# Altium project QCLogic Rev A.PrjPcb (part 1 of 2)
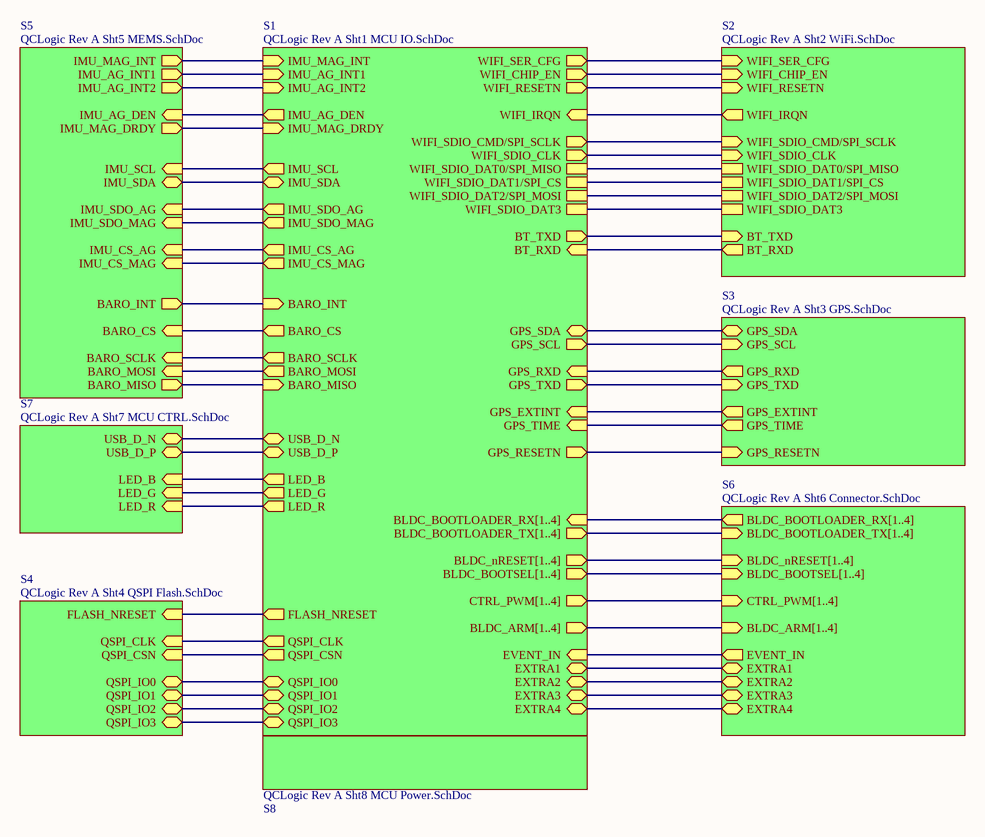
[diagram p0: QCLogic Rev A Sht0 Top.SchDoc]
9 sheets, 239 parts. Net scope: hierarchical (ports join the sheet entries above them; power ports are global).
Board file: QCLogic Rev A.PcbDoc
Sheets:
  QCLogic Rev A Sht0 Top.SchDoc
    S1 = QCLogic Rev A Sht1 MCU IO.SchDoc
    S2 = QCLogic Rev A Sht2 WiFi.SchDoc
    S3 = QCLogic Rev A Sht3 GPS.SchDoc
    S4 = QCLogic Rev A Sht4 QSPI Flash.SchDoc
    S5 = QCLogic Rev A Sht5 MEMS.SchDoc
    S6 = QCLogic Rev A Sht6 Connector.SchDoc
    S7 = QCLogic Rev A Sht7 MCU CTRL.SchDoc
    S8 = QCLogic Rev A Sht8 MCU Power.SchDoc

## Sheet QCLogic Rev A Sht0 Top.SchDoc
size A4

### Sub-sheets
S1 = QCLogic Rev A Sht1 MCU IO.SchDoc: IMU_MAG_INT (in), IMU_AG_INT1 (in), IMU_AG_INT2 (in), IMU_AG_DEN (out), IMU_MAG_DRDY (in), IMU_SCL (out), IMU_SDA (bidir), IMU_SDO_AG (out), IMU_SDO_MAG (out), IMU_CS_AG (out), IMU_CS_MAG (out), BARO_INT (in), BARO_CS (out), BARO_SCLK (out), BARO_MOSI (out), BARO_MISO (in), USB_D_N (bidir), USB_D_P (bidir), WIFI_SER_CFG (out), WIFI_CHIP_EN (out), WIFI_RESETN (out), WIFI_IRQN (in), WIFI_SDIO_CMD/SPI_SCLK (out), WIFI_SDIO_CLK (out), WIFI_SDIO_DAT0/SPI_MISO, WIFI_SDIO_DAT1/SPI_CS, WIFI_SDIO_DAT2/SPI_MOSI, WIFI_SDIO_DAT3, BT_TXD (out), BT_RXD (in), GPS_RXD (in), GPS_TXD (out), GPS_EXTINT (in), GPS_TIME (in), GPS_RESETN (out), GPS_SCL (out), GPS_SDA (bidir), BLDC_BOOTLOADER_RX[1..4] (in), BLDC_BOOTLOADER_TX[1..4] (out), BLDC_nRESET[1..4] (out), BLDC_BOOTSEL[1..4] (out), CTRL_PWM[1..4] (out), FLASH_NRESET (out), QSPI_CLK (out), QSPI_CSN (out), QSPI_IO0 (bidir), QSPI_IO1 (bidir), QSPI_IO2 (bidir), QSPI_IO3 (bidir), LED_B (out), LED_G (out), LED_R (out), BLDC_ARM[1..4] (out), EVENT_IN (in), EXTRA1 (bidir), EXTRA2 (bidir), EXTRA3 (bidir), EXTRA4 (bidir)
S2 = QCLogic Rev A Sht2 WiFi.SchDoc: WIFI_SER_CFG (in), WIFI_CHIP_EN (in), WIFI_RESETN (in), WIFI_IRQN (out), WIFI_SDIO_CMD/SPI_SCLK (in), WIFI_SDIO_CLK (in), WIFI_SDIO_DAT0/SPI_MISO, WIFI_SDIO_DAT1/SPI_CS, WIFI_SDIO_DAT2/SPI_MOSI, WIFI_SDIO_DAT3, BT_TXD (in), BT_RXD (out)
S3 = QCLogic Rev A Sht3 GPS.SchDoc: GPS_SDA (bidir), GPS_SCL (in), GPS_RXD (out), GPS_TXD (in), GPS_EXTINT (out), GPS_TIME (out), GPS_RESETN (in)
S4 = QCLogic Rev A Sht4 QSPI Flash.SchDoc: FLASH_NRESET (in), QSPI_CLK (in), QSPI_CSN (in), QSPI_IO0 (bidir), QSPI_IO1 (bidir), QSPI_IO2 (bidir), QSPI_IO3 (bidir)
S5 = QCLogic Rev A Sht5 MEMS.SchDoc: IMU_MAG_INT (out), IMU_AG_INT1 (out), IMU_AG_INT2 (out), IMU_AG_DEN (in), IMU_MAG_DRDY (out), IMU_SCL (in), IMU_SDA (bidir), IMU_SDO_AG (in), IMU_SDO_MAG (in), IMU_CS_AG (in), IMU_CS_MAG (in), BARO_INT (out), BARO_CS (in), BARO_SCLK (in), BARO_MOSI (in), BARO_MISO (out)
S6 = QCLogic Rev A Sht6 Connector.SchDoc: BLDC_BOOTLOADER_RX[1..4] (out), BLDC_BOOTLOADER_TX[1..4] (in), BLDC_nRESET[1..4] (in), BLDC_BOOTSEL[1..4] (in), CTRL_PWM[1..4] (in), BLDC_ARM[1..4] (in), EVENT_IN (out), EXTRA1 (bidir), EXTRA2 (bidir), EXTRA3 (bidir), EXTRA4 (bidir)
S7 = QCLogic Rev A Sht7 MCU CTRL.SchDoc: USB_D_N (bidir), USB_D_P (bidir), LED_B (in), LED_G (in), LED_R (in)
S8 = QCLogic Rev A Sht8 MCU Power.SchDoc: no entries

### Nets
BARO_CS: sheet S1/BARO_CS, sheet S5/BARO_CS
BARO_INT: sheet S1/BARO_INT, sheet S5/BARO_INT
BARO_MISO: sheet S1/BARO_MISO, sheet S5/BARO_MISO
BARO_MOSI: sheet S1/BARO_MOSI, sheet S5/BARO_MOSI
BARO_SCLK: sheet S1/BARO_SCLK, sheet S5/BARO_SCLK
BT_RXD: sheet S1/BT_RXD, sheet S2/BT_RXD
BT_TXD: sheet S1/BT_TXD, sheet S2/BT_TXD
EVENT_IN: sheet S1/EVENT_IN, sheet S6/EVENT_IN
EXTRA1: sheet S1/EXTRA1, sheet S6/EXTRA1
EXTRA2: sheet S1/EXTRA2, sheet S6/EXTRA2
EXTRA3: sheet S1/EXTRA3, sheet S6/EXTRA3
EXTRA4: sheet S1/EXTRA4, sheet S6/EXTRA4
FLASH_NRESET: sheet S1/FLASH_NRESET, sheet S4/FLASH_NRESET
GPS_EXTINT: sheet S1/GPS_EXTINT, sheet S3/GPS_EXTINT
GPS_RESETN: sheet S1/GPS_RESETN, sheet S3/GPS_RESETN
GPS_RXD: sheet S1/GPS_RXD, sheet S3/GPS_RXD
GPS_SCL: sheet S1/GPS_SCL, sheet S3/GPS_SCL
GPS_SDA: sheet S1/GPS_SDA, sheet S3/GPS_SDA
GPS_TIME: sheet S1/GPS_TIME, sheet S3/GPS_TIME
GPS_TXD: sheet S1/GPS_TXD, sheet S3/GPS_TXD
IMU_AG_DEN: sheet S1/IMU_AG_DEN, sheet S5/IMU_AG_DEN
IMU_AG_INT1: sheet S1/IMU_AG_INT1, sheet S5/IMU_AG_INT1
IMU_AG_INT2: sheet S1/IMU_AG_INT2, sheet S5/IMU_AG_INT2
IMU_CS_AG: sheet S1/IMU_CS_AG, sheet S5/IMU_CS_AG
IMU_CS_MAG: sheet S1/IMU_CS_MAG, sheet S5/IMU_CS_MAG
IMU_INT_MAG: sheet S1/IMU_MAG_INT, sheet S5/IMU_MAG_INT
IMU_MAG_DRDY: sheet S1/IMU_MAG_DRDY, sheet S5/IMU_MAG_DRDY
IMU_SCL: sheet S1/IMU_SCL, sheet S5/IMU_SCL
IMU_SDA: sheet S1/IMU_SDA, sheet S5/IMU_SDA
IMU_SDO_AG: sheet S1/IMU_SDO_AG, sheet S5/IMU_SDO_AG
IMU_SDO_MAG: sheet S1/IMU_SDO_MAG, sheet S5/IMU_SDO_MAG
LED_B: sheet S1/LED_B, sheet S7/LED_B
LED_G: sheet S1/LED_G, sheet S7/LED_G
LED_R: sheet S1/LED_R, sheet S7/LED_R
QSPI_CLK: sheet S1/QSPI_CLK, sheet S4/QSPI_CLK
QSPI_CSN: sheet S1/QSPI_CSN, sheet S4/QSPI_CSN
QSPI_IO0: sheet S1/QSPI_IO0, sheet S4/QSPI_IO0
QSPI_IO1: sheet S1/QSPI_IO1, sheet S4/QSPI_IO1
QSPI_IO2: sheet S1/QSPI_IO2, sheet S4/QSPI_IO2
QSPI_IO3: sheet S1/QSPI_IO3, sheet S4/QSPI_IO3
USB_D_N: sheet S1/USB_D_N, sheet S7/USB_D_N
USB_D_P: sheet S1/USB_D_P, sheet S7/USB_D_P
WIFI_CHIP_EN: sheet S1/WIFI_CHIP_EN, sheet S2/WIFI_CHIP_EN
WIFI_IRQN: sheet S1/WIFI_IRQN, sheet S2/WIFI_IRQN
WIFI_RESETN: sheet S1/WIFI_RESETN, sheet S2/WIFI_RESETN
WIFI_SDIO_CLK: sheet S1/WIFI_SDIO_CLK, sheet S2/WIFI_SDIO_CLK
WIFI_SDIO_CMD/SPI_SCLK: sheet S1/WIFI_SDIO_CMD/SPI_SCLK, sheet S2/WIFI_SDIO_CMD/SPI_SCLK
WIFI_SDIO_DAT0/SPI_MISO: sheet S1/WIFI_SDIO_DAT0/SPI_MISO, sheet S2/WIFI_SDIO_DAT0/SPI_MISO
WIFI_SDIO_DAT1/SPI_CS: sheet S1/WIFI_SDIO_DAT1/SPI_CS, sheet S2/WIFI_SDIO_DAT1/SPI_CS
WIFI_SDIO_DAT2/SPI_MOSI: sheet S1/WIFI_SDIO_DAT2/SPI_MOSI, sheet S2/WIFI_SDIO_DAT2/SPI_MOSI
WIFI_SDIO_DAT3: sheet S1/WIFI_SDIO_DAT3, sheet S2/WIFI_SDIO_DAT3
WIFI_SER_CFG: sheet S1/WIFI_SER_CFG, sheet S2/WIFI_SER_CFG

### Buses and harness runs
bus sheet S1/BLDC_ARM[1..4] = sheet S6/BLDC_ARM[1..4]
bus sheet S1/BLDC_BOOTLOADER_RX[1..4] = sheet S6/BLDC_BOOTLOADER_RX[1..4]
bus sheet S1/BLDC_BOOTLOADER_TX[1..4] = sheet S6/BLDC_BOOTLOADER_TX[1..4]
bus sheet S1/BLDC_BOOTSEL[1..4] = sheet S6/BLDC_BOOTSEL[1..4]
bus sheet S1/BLDC_nRESET[1..4] = sheet S6/BLDC_nRESET[1..4]
bus sheet S1/CTRL_PWM[1..4] = sheet S6/CTRL_PWM[1..4]

## Sheet QCLogic Rev A Sht1 MCU IO.SchDoc
size A3
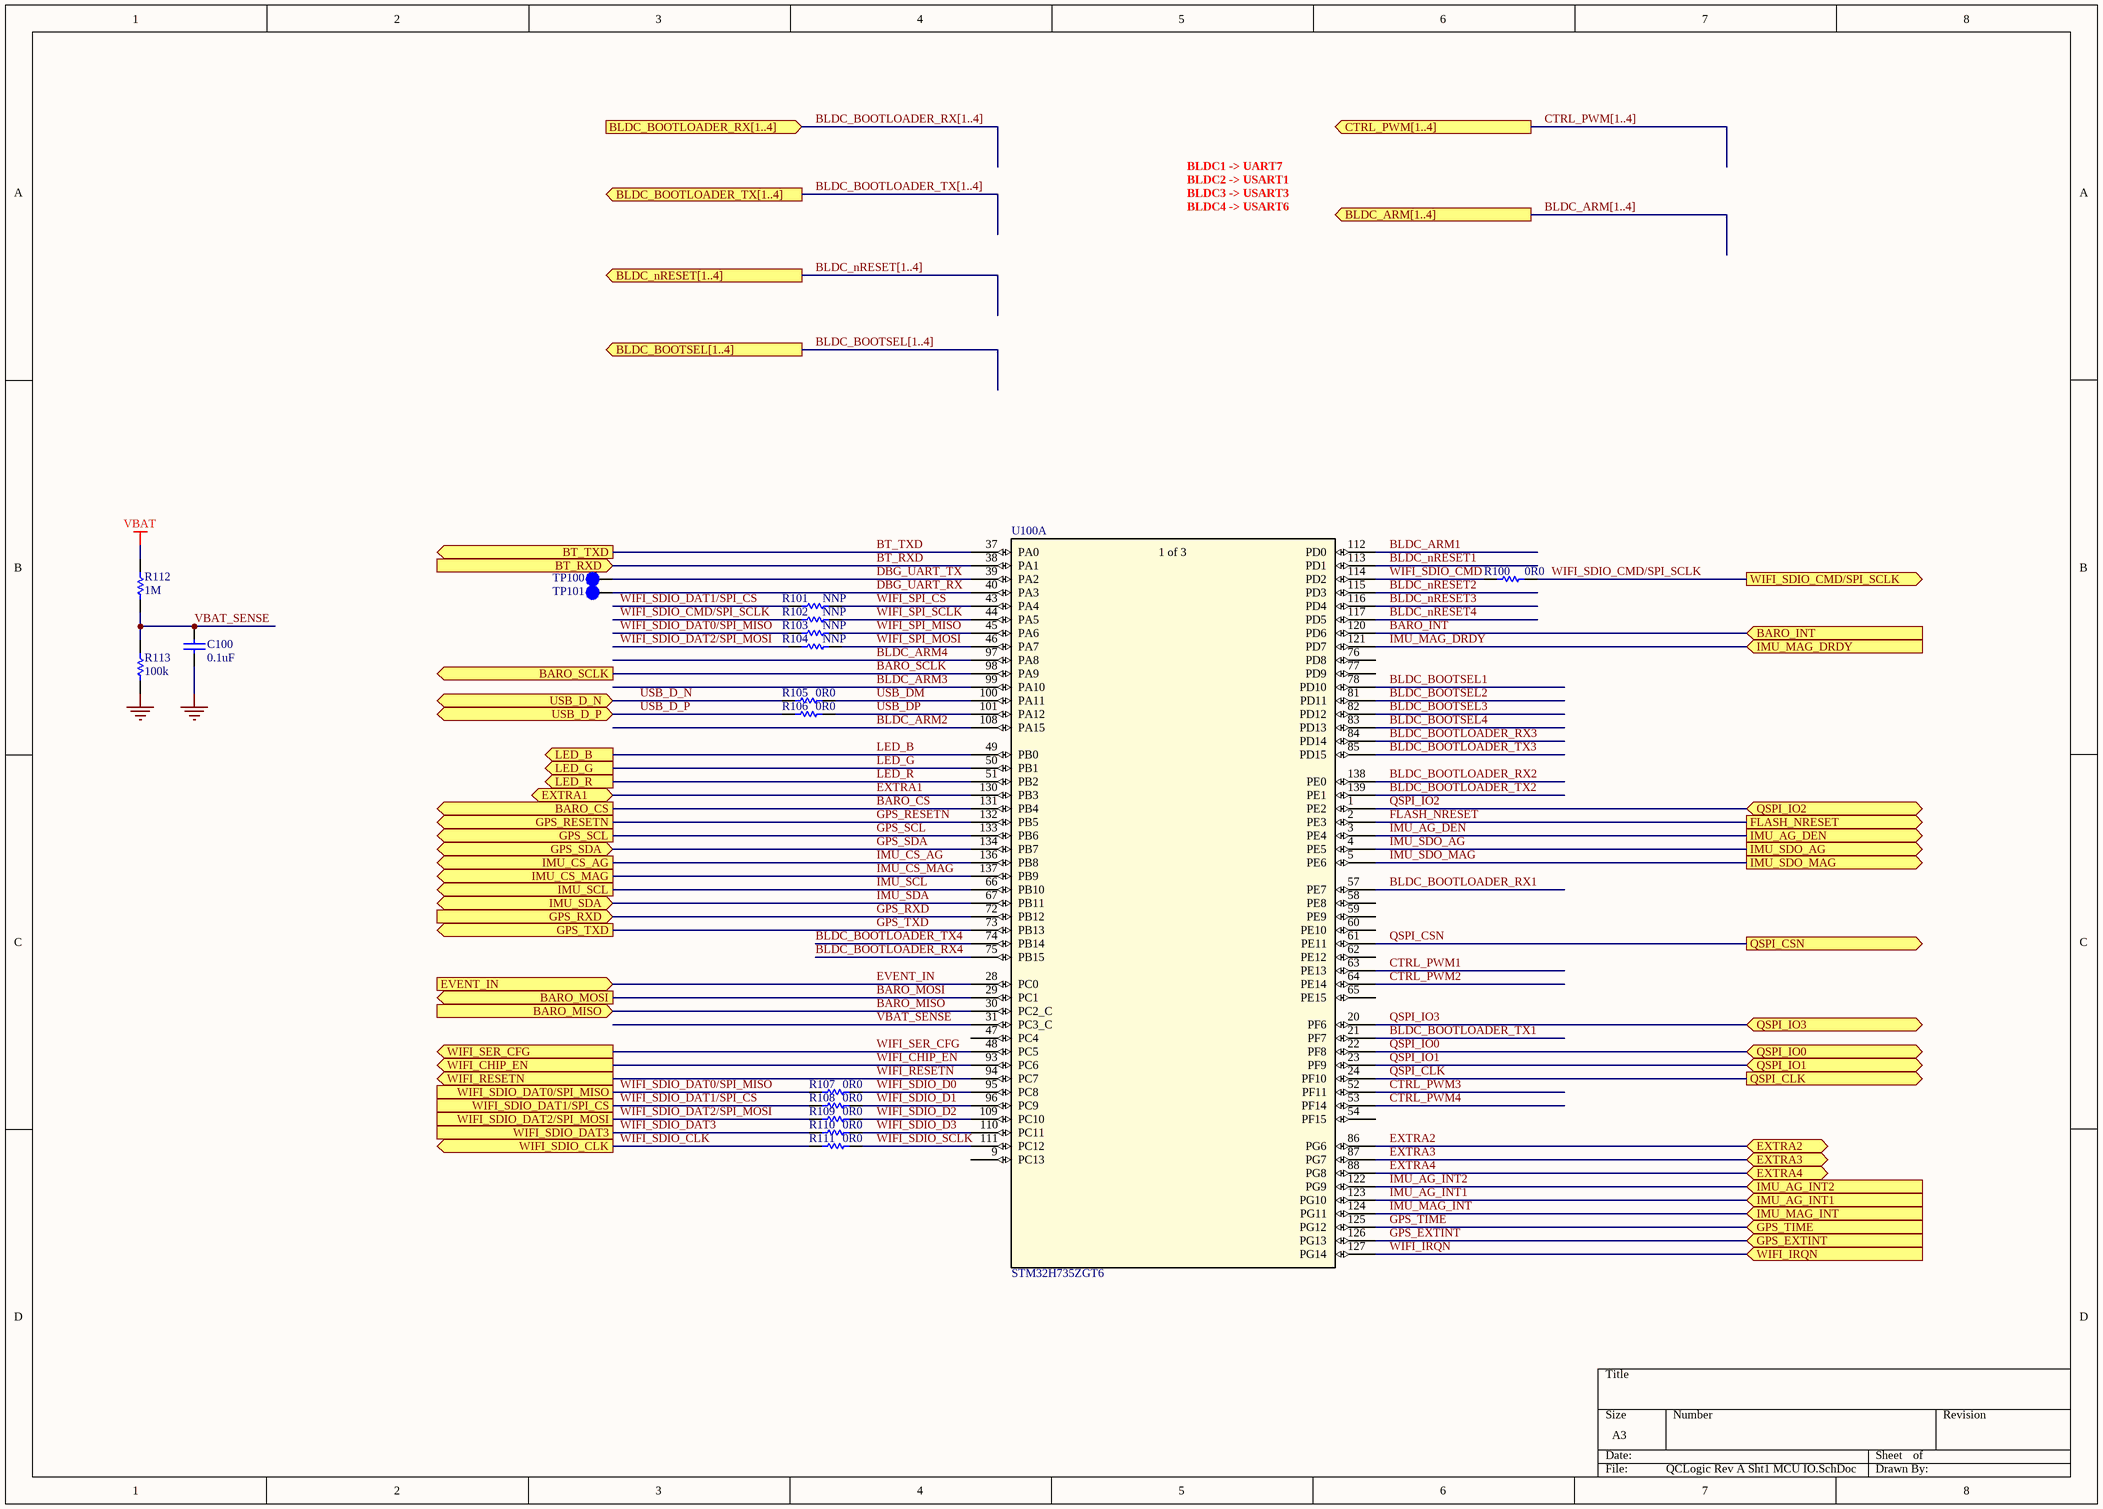
[diagram p1: QCLogic Rev A Sht1 MCU IO.SchDoc]

### Parts
C100  0.1uF  [SMD CAP 0402]
R100  0R0  [SMD RES 0402]
R101  NNP  [SMD RES 0402]  (no BOM)
R102  NNP  [SMD RES 0402]  (no BOM)
R103  NNP  [SMD RES 0402]  (no BOM)
R104  NNP  [SMD RES 0402]  (no BOM)
R105  0R0  [SMD RES 0402]
R106  0R0  [SMD RES 0402]
R107  0R0  [SMD RES 0402]
R108  0R0  [SMD RES 0402]
R109  0R0  [SMD RES 0402]
R110  0R0  [SMD RES 0402]
R111  0R0  [SMD RES 0402]
R112  1M  [SMD RES 0402]
R113  100k  [SMD RES 0402]
TP100  TESTPOINT SMD  [TESTPOINT 1mm DIA]  (value not drawn)  (no BOM)
TP101  TESTPOINT SMD  [TESTPOINT 1mm DIA]  (value not drawn)  (no BOM)
U100  STM32H735ZGT6  [LQFP-144 20x20]  (part A of 3)

### Ports
BARO_CS (out), BARO_INT (in), BARO_MISO (in), BARO_MOSI (out), BARO_SCLK (out), BLDC_ARM[1..4] (out), BLDC_BOOTLOADER_RX[1..4] (in), BLDC_BOOTLOADER_TX[1..4] (out), BLDC_BOOTSEL[1..4] (out), BLDC_nRESET[1..4] (out), BT_RXD (in), BT_TXD (out), CTRL_PWM[1..4] (out), EVENT_IN (in), EXTRA1 (bidir), EXTRA2 (bidir), EXTRA3 (bidir), EXTRA4 (bidir), FLASH_NRESET (out), GPS_EXTINT (in), GPS_RESETN (out), GPS_RXD (in), GPS_SCL (out), GPS_SDA (bidir), GPS_TIME (in), GPS_TXD (out), IMU_AG_DEN (out), IMU_AG_INT1 (in), IMU_AG_INT2 (in), IMU_CS_AG (out), IMU_CS_MAG (out), IMU_MAG_DRDY (in), IMU_MAG_INT (in), IMU_SCL (out), IMU_SDA (bidir), IMU_SDO_AG (out), IMU_SDO_MAG (out), LED_B (out), LED_G (out), LED_R (out), QSPI_CLK (out), QSPI_CSN (out), QSPI_IO0 (bidir), QSPI_IO1 (bidir), QSPI_IO2 (bidir), QSPI_IO3 (bidir), USB_D_N (bidir), USB_D_P (bidir), WIFI_CHIP_EN (out), WIFI_IRQN (in), WIFI_RESETN (out), WIFI_SDIO_CLK (out), WIFI_SDIO_CMD/SPI_SCLK (out), WIFI_SDIO_DAT0/SPI_MISO, WIFI_SDIO_DAT1/SPI_CS, WIFI_SDIO_DAT2/SPI_MOSI, WIFI_SDIO_DAT3, WIFI_SER_CFG (out)

### Nets
GND: C100.1 R113.2
VBAT: R112.1
BARO_CS: U100.131(PB4) ; port BARO_CS
BARO_INT: U100.120(PD6) ; port BARO_INT
BARO_MISO: U100.30(PC2_C) ; port BARO_MISO
BARO_MOSI: U100.29(PC1) ; port BARO_MOSI
BARO_SCLK: U100.98(PA9) ; port BARO_SCLK
BLDC_ARM1: U100.112(PD0)
BLDC_ARM2: U100.108(PA15)
BLDC_ARM3: U100.99(PA10)
BLDC_ARM4: U100.97(PA8)
BLDC_BOOTLOADER_RX1: U100.57(PE7)
BLDC_BOOTLOADER_RX2: U100.138(PE0)
BLDC_BOOTLOADER_RX3: U100.84(PD14)
BLDC_BOOTLOADER_RX4: U100.75(PB15)
BLDC_BOOTLOADER_TX1: U100.21(PF7)
BLDC_BOOTLOADER_TX2: U100.139(PE1)
BLDC_BOOTLOADER_TX3: U100.85(PD15)
BLDC_BOOTLOADER_TX4: U100.74(PB14)
BLDC_BOOTSEL1: U100.78(PD10)
BLDC_BOOTSEL2: U100.81(PD11)
BLDC_BOOTSEL3: U100.82(PD12)
BLDC_BOOTSEL4: U100.83(PD13)
BLDC_nRESET1: U100.113(PD1)
BLDC_nRESET2: U100.115(PD3)
BLDC_nRESET3: U100.116(PD4)
BLDC_nRESET4: U100.117(PD5)
BT_RXD: U100.38(PA1) ; port BT_RXD
BT_TXD: U100.37(PA0) ; port BT_TXD
CTRL_PWM1: U100.63(PE13)
CTRL_PWM2: U100.64(PE14)
CTRL_PWM3: U100.52(PF11)
CTRL_PWM4: U100.53(PF14)
DBG_UART_RX: TP101.1 U100.40(PA3)
DBG_UART_TX: TP100.1 U100.39(PA2)
EVENT_IN: U100.28(PC0) ; port EVENT_IN
EXTRA1: U100.130(PB3) ; port EXTRA1
EXTRA2: U100.86(PG6) ; port EXTRA2
EXTRA3: U100.87(PG7) ; port EXTRA3
EXTRA4: U100.88(PG8) ; port EXTRA4
FLASH_NRESET: U100.2(PE3) ; port FLASH_NRESET
GPS_EXTINT: U100.126(PG13) ; port GPS_EXTINT
GPS_RESETN: U100.132(PB5) ; port GPS_RESETN
GPS_RXD: U100.72(PB12) ; port GPS_RXD
GPS_SCL: U100.133(PB6) ; port GPS_SCL
GPS_SDA: U100.134(PB7) ; port GPS_SDA
GPS_TIME: U100.125(PG12) ; port GPS_TIME
GPS_TXD: U100.73(PB13) ; port GPS_TXD
IMU_AG_DEN: U100.3(PE4) ; port IMU_AG_DEN
IMU_AG_INT1: U100.123(PG10) ; port IMU_AG_INT1
IMU_AG_INT2: U100.122(PG9) ; port IMU_AG_INT2
IMU_CS_AG: U100.136(PB8) ; port IMU_CS_AG
IMU_CS_MAG: U100.137(PB9) ; port IMU_CS_MAG
IMU_MAG_DRDY: U100.121(PD7) ; port IMU_MAG_DRDY
IMU_MAG_INT: U100.124(PG11) ; port IMU_MAG_INT  [project net IMU_INT_MAG]
IMU_SCL: U100.66(PB10) ; port IMU_SCL
IMU_SDA: U100.67(PB11) ; port IMU_SDA
IMU_SDO_AG: U100.4(PE5) ; port IMU_SDO_AG
IMU_SDO_MAG: U100.5(PE6) ; port IMU_SDO_MAG
LED_B: U100.49(PB0) ; port LED_B
LED_G: U100.50(PB1) ; port LED_G
LED_R: U100.51(PB2) ; port LED_R
QSPI_CLK: U100.24(PF10) ; port QSPI_CLK
QSPI_CSN: U100.61(PE11) ; port QSPI_CSN
QSPI_IO0: U100.22(PF8) ; port QSPI_IO0
QSPI_IO1: U100.23(PF9) ; port QSPI_IO1
QSPI_IO2: U100.1(PE2) ; port QSPI_IO2
QSPI_IO3: U100.20(PF6) ; port QSPI_IO3
USB_D_N: R105.1 ; port USB_D_N
USB_D_P: R106.1 ; port USB_D_P
USB_DM: R105.2 U100.100(PA11)
USB_DP: R106.2 U100.101(PA12)
VBAT_SENSE: C100.2 R112.2 R113.1 U100.31(PC3_C)
WIFI_CHIP_EN: U100.93(PC6) ; port WIFI_CHIP_EN
WIFI_IRQN: U100.127(PG14) ; port WIFI_IRQN
WIFI_RESETN: U100.94(PC7) ; port WIFI_RESETN
WIFI_SDIO_CLK: R111.1 ; port WIFI_SDIO_CLK
WIFI_SDIO_CMD: R100.2 U100.114(PD2)
WIFI_SDIO_CMD/SPI_SCLK: R100.1 R102.1 ; port WIFI_SDIO_CMD/SPI_SCLK
WIFI_SDIO_D0: R107.2 U100.95(PC8)
WIFI_SDIO_D1: R108.2 U100.96(PC9)
WIFI_SDIO_D2: R109.2 U100.109(PC10)
WIFI_SDIO_D3: R110.2 U100.110(PC11)
WIFI_SDIO_DAT0/SPI_MISO: R103.1 R107.1 ; port WIFI_SDIO_DAT0/SPI_MISO
WIFI_SDIO_DAT1/SPI_CS: R101.2 R108.1 ; port WIFI_SDIO_DAT1/SPI_CS
WIFI_SDIO_DAT2/SPI_MOSI: R104.1 R109.1 ; port WIFI_SDIO_DAT2/SPI_MOSI
WIFI_SDIO_DAT3: R110.1 ; port WIFI_SDIO_DAT3
WIFI_SDIO_SCLK: R111.2 U100.111(PC12)
WIFI_SER_CFG: U100.48(PC5) ; port WIFI_SER_CFG
WIFI_SPI_CS: R101.1 U100.43(PA4)
WIFI_SPI_MISO: R103.2 U100.45(PA6)
WIFI_SPI_MOSI: R104.2 U100.46(PA7)
WIFI_SPI_SCLK: R102.2 U100.44(PA5)

Not connected (* = marked no-connect by the designer): U100 9(PC13) 47(PC4) 54(PF15) 58(PE8) 59(PE9) 60(PE10) 62(PE12) 65(PE15) 76(PD8) 77(PD9)

### Buses and harness runs
bus BLDC_ARM[1..4] = port BLDC_ARM[1..4]
bus BLDC_BOOTLOADER_RX[1..4] = port BLDC_BOOTLOADER_RX[1..4]
bus BLDC_BOOTLOADER_TX[1..4] = port BLDC_BOOTLOADER_TX[1..4]
bus BLDC_BOOTSEL[1..4] = port BLDC_BOOTSEL[1..4]
bus BLDC_nRESET[1..4] = port BLDC_nRESET[1..4]
bus CTRL_PWM[1..4] = port CTRL_PWM[1..4]

### Notes on the sheet
- BLDC1 -> UART7
- BLDC2 -> USART1
- BLDC3 -> USART3
- BLDC4 -> USART6
- (in symbol IC MCU STM32H735ZG Arm M7, part A) 1 of 3

### Library data of the parts
C100 = CAP MLCC SMD: CAP CER 0.1UF 25V X7R 0402; 1. Manufacturer: Yageo; 2. Manufacturer Part Number: CC0402KRX7R8BB104; 4. Package: 0402; 3. Date Modified: 20201122
R100-R111 = RES SMD: RES SMD 0 OHM JUMPER 1/16W 0402; 1. Manufacturer: Yageo; 2. Manufacturer Part Number: RC0402FR-070RL; 4. Package: 0402; 3. Date Modified: 20201122
R112 = RES SMD: RES SMD 1M OHM 1% 1/16W 0402; 1. Manufacturer: Yageo; 2. Manufacturer Part Number: RC0402FR-071ML; 4. Package: 0402; 3. Date Modified: 20201127
R113 = RES SMD: RES SMD 100K OHM 1% 1/16W 0402; 1. Manufacturer: Yageo; 2. Manufacturer Part Number: RC0402FR-07100KL; 4. Package: 0402; 3. Date Modified: 20201126
TP100 TP101 = TESTPOINT PAD: TESTPOINT SMD PAD; 1. Manufacturer: *; 2. Manufacturer Part Number: *; 3. Date Modified: *
U100 = IC MCU STM32H735ZG Arm M7: ARM® Cortex®-M7 STM32H7 Microcontroller IC 32-Bit 550MHz 1MB (1M x 8) FLASH 144 LQFP 20x20; 1. Manufacturer: STMicroelectronics; 2. Manufacturer Part Number: STM32H735ZGT6; 3. Date Modified: 20201126

## Sheet QCLogic Rev A Sht2 WiFi.SchDoc
size A4
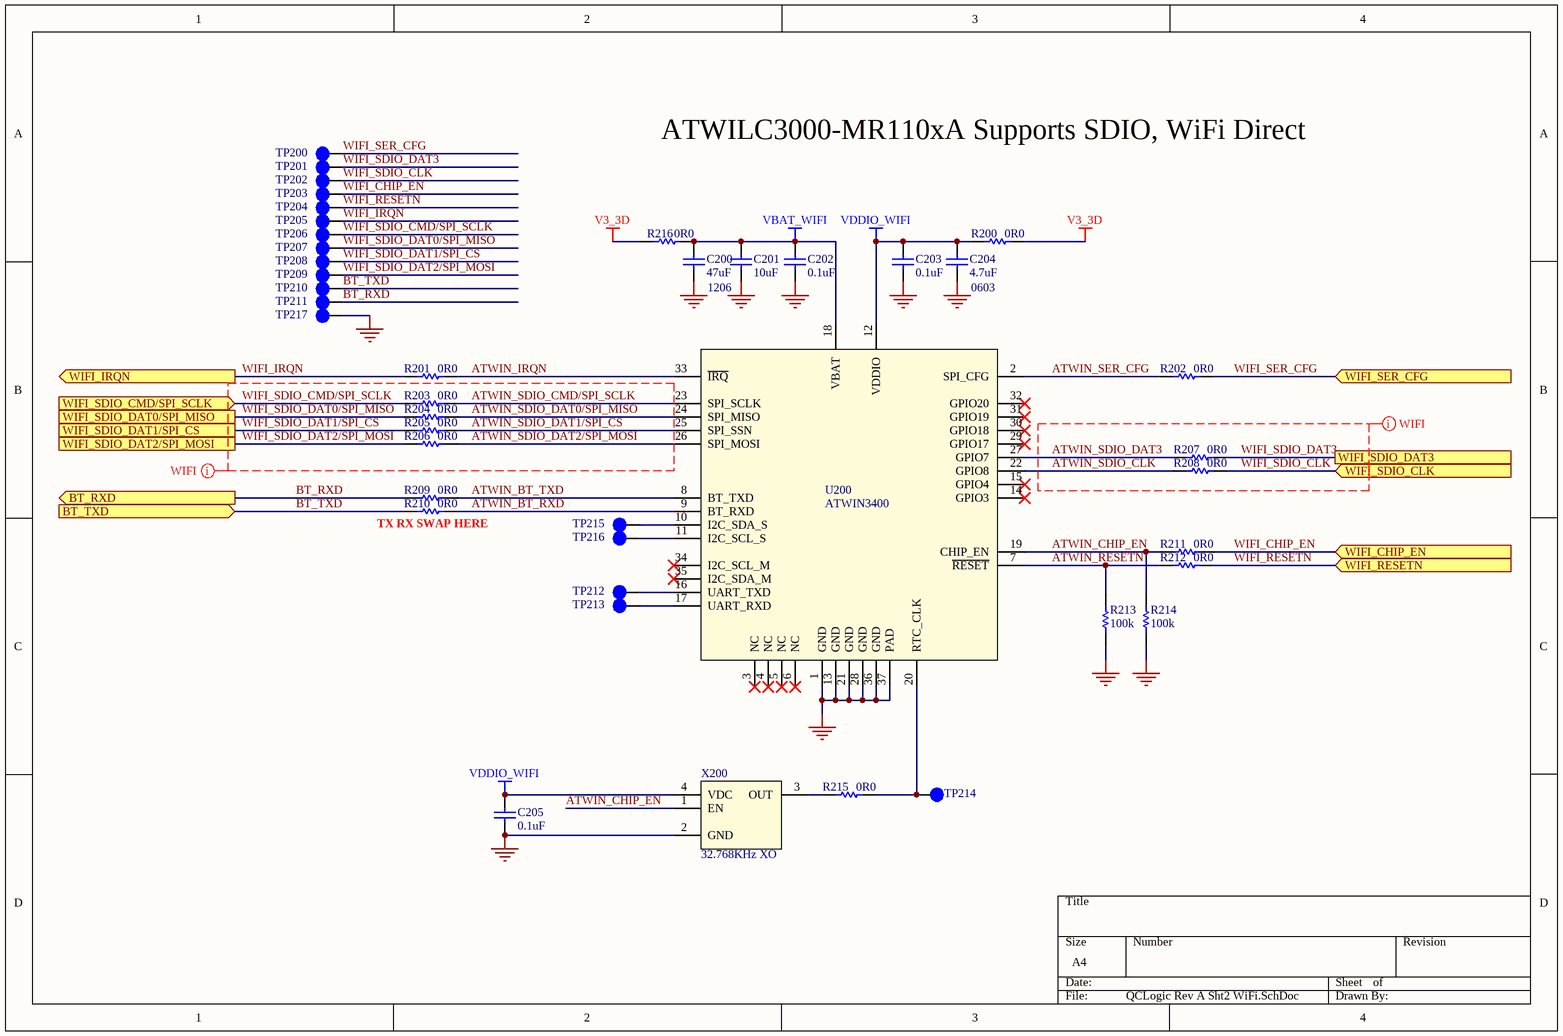
[diagram p2: QCLogic Rev A Sht2 WiFi.SchDoc]

### Parts
C200  47uF  4. Package: 1206  [SMD CAP 1206]
C201  10uF  [SMD CAP 0805]
C202  0.1uF  [SMD CAP 0402]
C203  0.1uF  [SMD CAP 0402]
C204  4.7uF  4. Package: 0603  [SMD CAP 0603]
C205  0.1uF  [SMD CAP 0402]
R200  0R0  [SMD RES 0402]
R201  0R0  [SMD RES 0402]
R202  0R0  [SMD RES 0402]
R203  0R0  [SMD RES 0402]
R204  0R0  [SMD RES 0402]
R205  0R0  [SMD RES 0402]
R206  0R0  [SMD RES 0402]
R207  0R0  [SMD RES 0402]
R208  0R0  [SMD RES 0402]
R209  0R0  [SMD RES 0402]
R210  0R0  [SMD RES 0402]
R211  0R0  [SMD RES 0402]
R212  0R0  [SMD RES 0402]
R213  100k  [SMD RES 0402]
R214  100k  [SMD RES 0402]
R215  0R0  [SMD RES 0402]
R216  0R0  [SMD RES 0402]
TP200  TESTPOINT SMD  [TESTPOINT 0.5mm DIA]  (value not drawn)  (no BOM)
TP201  TESTPOINT SMD  [TESTPOINT 0.5mm DIA]  (value not drawn)  (no BOM)
TP202  TESTPOINT SMD  [TESTPOINT 0.5mm DIA]  (value not drawn)  (no BOM)
TP203  TESTPOINT SMD  [TESTPOINT 0.5mm DIA]  (value not drawn)  (no BOM)
TP204  TESTPOINT SMD  [TESTPOINT 0.5mm DIA]  (value not drawn)  (no BOM)
TP205  TESTPOINT SMD  [TESTPOINT 0.5mm DIA]  (value not drawn)  (no BOM)
TP206  TESTPOINT SMD  [TESTPOINT 0.5mm DIA]  (value not drawn)  (no BOM)
TP207  TESTPOINT SMD  [TESTPOINT 0.5mm DIA]  (value not drawn)  (no BOM)
TP208  TESTPOINT SMD  [TESTPOINT 0.5mm DIA]  (value not drawn)  (no BOM)
TP209  TESTPOINT SMD  [TESTPOINT 0.5mm DIA]  (value not drawn)  (no BOM)
TP210  TESTPOINT SMD  [TESTPOINT 0.5mm DIA]  (value not drawn)  (no BOM)
TP211  TESTPOINT SMD  [TESTPOINT 0.5mm DIA]  (value not drawn)  (no BOM)
TP212  TESTPOINT SMD  [TESTPOINT 0.5mm DIA]  (value not drawn)  (no BOM)
TP213  TESTPOINT SMD  [TESTPOINT 0.5mm DIA]  (value not drawn)  (no BOM)
TP214  TESTPOINT SMD  [TESTPOINT 0.5mm DIA]  (value not drawn)  (no BOM)
TP215  TESTPOINT SMD  [TESTPOINT 0.5mm DIA]  (value not drawn)  (no BOM)
TP216  TESTPOINT SMD  [TESTPOINT 0.5mm DIA]  (value not drawn)  (no BOM)
TP217  TESTPOINT SMD  [TESTPOINT 1mm DIA]  (value not drawn)  (no BOM)
U200  ATWIN3400  [ATWINC3400-MR210CA]
X200  32.768KHz XO  [XTAL OSC 32.768K CMOS]

### Ports
BT_RXD (out), BT_TXD (in), WIFI_CHIP_EN (in), WIFI_IRQN (out), WIFI_RESETN (in), WIFI_SDIO_CLK (in), WIFI_SDIO_CMD/SPI_SCLK (in), WIFI_SDIO_DAT0/SPI_MISO, WIFI_SDIO_DAT1/SPI_CS, WIFI_SDIO_DAT2/SPI_MOSI, WIFI_SDIO_DAT3, WIFI_SER_CFG (in)

### Nets
GND: C200.2 C201.2 C202.1 C203.1 C204.2 C205.1 R213.2 R214.2 TP217.1 U200.1(GND) U200.13(GND) U200.21(GND) U200.28(GND) U200.36(GND) U200.37(PAD) X200.2(GND)
V3_3D: R200.2 R216.1
VBAT_WIFI: C200.1 C201.1 C202.2 R216.2 U200.18(VBAT)
VDDIO_WIFI: C203.2 C204.1 C205.2 R200.1 U200.12(VDDIO) X200.4(VDC)
ATWIN_BT_RXD: R210.2 U200.9(BT_RXD)
ATWIN_BT_TXD: R209.2 U200.8(BT_TXD)
ATWIN_CHIP_EN: R211.1 R214.1 U200.19(CHIP_EN) X200.1(EN)
ATWIN_IRQN: R201.2 U200.33(~{IRQ})
ATWIN_RESETN: R212.1 R213.1 U200.7(~{RESET})
ATWIN_SDIO_CLK: R208.1 U200.22(GPIO8)
ATWIN_SDIO_CMD/SPI_SCLK: R203.2 U200.23(SPI_SCLK)
ATWIN_SDIO_DAT0/SPI_MISO: R204.2 U200.24(SPI_MISO)
ATWIN_SDIO_DAT1/SPI_CS: R205.2 U200.25(SPI_SSN)
ATWIN_SDIO_DAT2/SPI_MOSI: R206.2 U200.26(SPI_MOSI)
ATWIN_SDIO_DAT3: R207.1 U200.27(GPIO7)
ATWIN_SER_CFG: R202.1 U200.2(SPI_CFG)
BT_RXD: R209.1 TP211.1 ; port BT_RXD
BT_TXD: R210.1 TP210.1 ; port BT_TXD
WIFI_CHIP_EN: R211.2 TP203.1 ; port WIFI_CHIP_EN
WIFI_IRQN: R201.1 TP205.1 ; port WIFI_IRQN
WIFI_RESETN: R212.2 TP204.1 ; port WIFI_RESETN
WIFI_SDIO_CLK: R208.2 TP202.1 ; port WIFI_SDIO_CLK
WIFI_SDIO_CMD/SPI_SCLK: R203.1 TP206.1 ; port WIFI_SDIO_CMD/SPI_SCLK
WIFI_SDIO_DAT0/SPI_MISO: R204.1 TP207.1 ; port WIFI_SDIO_DAT0/SPI_MISO
WIFI_SDIO_DAT1/SPI_CS: R205.1 TP208.1 ; port WIFI_SDIO_DAT1/SPI_CS
WIFI_SDIO_DAT2/SPI_MOSI: R206.1 TP209.1 ; port WIFI_SDIO_DAT2/SPI_MOSI
WIFI_SDIO_DAT3: R207.2 TP201.1 ; port WIFI_SDIO_DAT3
WIFI_SER_CFG: R202.2 TP200.1 ; port WIFI_SER_CFG
NetR215_1: R215.1 X200.3(OUT)
NetR215_2: R215.2 TP214.1 U200.20(RTC_CLK)
NetTP212_1: TP212.1 U200.16(UART_TXD)
NetTP213_1: TP213.1 U200.17(UART_RXD)
NetTP215_1: TP215.1 U200.10(I2C_SDA_S)
NetTP216_1: TP216.1 U200.11(I2C_SCL_S)

Not connected (* = marked no-connect by the designer): U200 3(NC)* 4(NC)* 5(NC)* 6(NC)* 14(GPIO3)* 15(GPIO4)* 29(GPIO17)* 30(GPIO18)* 31(GPIO19)* 32(GPIO20)* 34(I2C_SCL_M)* 35(I2C_SDA_M)*

### Layout directives
net class WIFI: ATWIN_SDIO_CLK, ATWIN_SDIO_CMD/SPI_SCLK, ATWIN_SDIO_DAT0/SPI_MISO, ATWIN_SDIO_DAT1/SPI_CS, ATWIN_SDIO_DAT2/SPI_MOSI, ATWIN_SDIO_DAT3, WIFI_SDIO_CLK, WIFI_SDIO_CMD/SPI_SCLK, WIFI_SDIO_DAT0/SPI_MISO, WIFI_SDIO_DAT1/SPI_CS, WIFI_SDIO_DAT2/SPI_MOSI, WIFI_SDIO_DAT3

### Notes on the sheet
- ATWILC3000-MR110xA Supports SDIO, WiFi Direct
- (near R210) TX RX SWAP HERE

### Library data of the parts
C200 = CAP MLCC SMD: CAP CER 47UF 10V X5R 1206; 1. Manufacturer: Samsung Electro-Mechanics; 2. Manufacturer Part Number: CL31A476MPHNNNE; 3. Date Modified: 20201128
C201 = CAP MLCC SMD: CAP CER 10UF 25V X5R 0805; 1. Manufacturer: Taiyo Yuden; 2. Manufacturer Part Number: TMK212BBJ106KG-T; 4. Package: 0805; 3. Date Modified: 20201128
C202 C203 C205 = CAP MLCC SMD: as C100 on sheet QCLogic Rev A Sht1 MCU IO; 3. Date Modified: 20201122
C204 = CAP MLCC SMD: CAP CER 4.7UF 16V X7S 0603; 1. Manufacturer: Murata Electronics; 2. Manufacturer Part Number: GRM188C71C475KE21D; 3. Date Modified: 20200906
R200-R212 R215 R216 = RES SMD: as R100 on sheet QCLogic Rev A Sht1 MCU IO; 3. Date Modified: 20201122
R213 R214 = RES SMD: as R113 on sheet QCLogic Rev A Sht1 MCU IO; 3. Date Modified: 20201126
TP200-TP217 = TESTPOINT PAD: TESTPOINT SMD PAD; 1. Manufacturer: *; 2. Manufacturer Part Number: *; 3. Date Modified: *
U200 = MODULE WIFI 802_11BGN CHIP SMD: Bluetooth, WiFi 802.11b/g/n, Bluetooth v5.0 Transceiver Module 2.412GHz ~ 2.472GHz Integrated, Chip Surface Mount; 1. Manufacturer: Microchip Technology; 2. Manufacturer Part Number: ATWINC3400-MR210CA131-T; 3. Date Modified: 20201122
X200 = OSC XO 32.768KHZ HCMOS SMD: 1. Manufacturer: Jauch Quartz; 2. Manufacturer Part Number: O 0,032768-JO32-G-1V3-1-T1-LF; 3. Date Modified: 20201122

## Sheet QCLogic Rev A Sht3 GPS.SchDoc
size A4
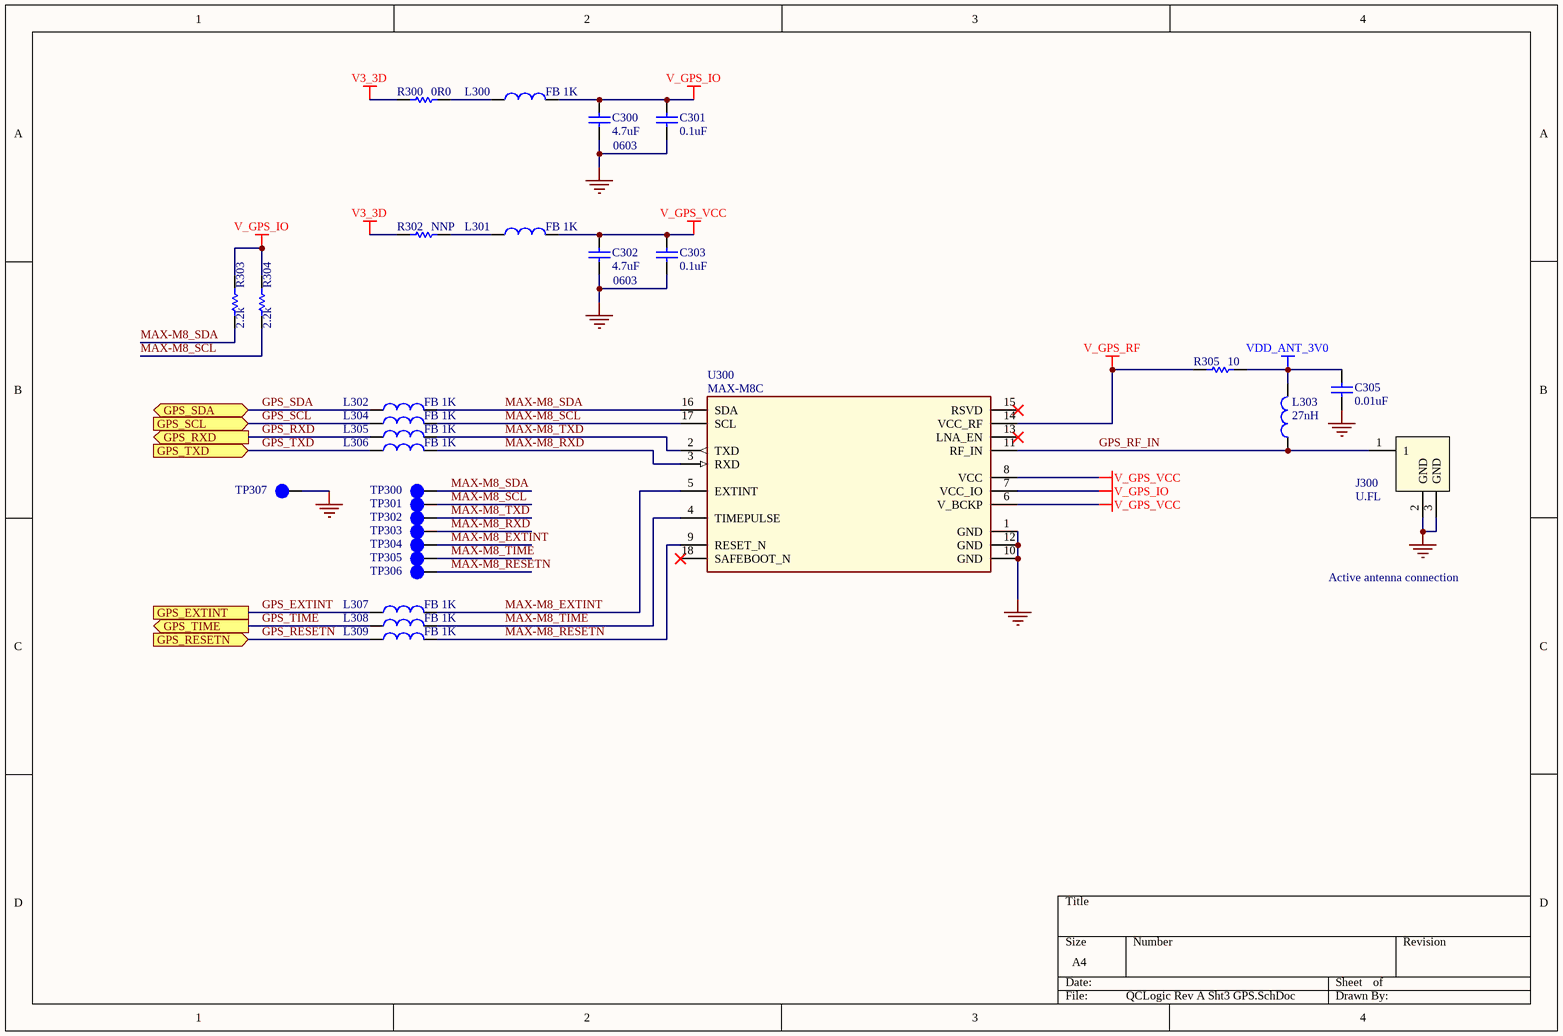
[diagram p3: QCLogic Rev A Sht3 GPS.SchDoc]

### Parts
C300  4.7uF  4. Package: 0603  [SMD CAP 0603]
C301  0.1uF  [SMD CAP 0402]
C302  4.7uF  4. Package: 0603  [SMD CAP 0603]
C303  0.1uF  [SMD CAP 0402]
C305  0.01uF  [SMD CAP 0402]
J300  U.FL  [U.FL]
L300  FB 1K  [SMD RES 0402]
L301  FB 1K  [SMD RES 0402]
L302  FB 1K  [SMD RES 0402]
L303  27nH  [SMD RES 0402]
L304  FB 1K  [SMD RES 0402]
L305  FB 1K  [SMD RES 0402]
L306  FB 1K  [SMD RES 0402]
L307  FB 1K  [SMD RES 0402]
L308  FB 1K  [SMD RES 0402]
L309  FB 1K  [SMD RES 0402]
R300  0R0  [SMD RES 0402]
R302  NNP  [SMD RES 0402]  (no BOM)
R303  2.2k  [SMD RES 0402]
R304  2.2k  [SMD RES 0402]
R305  10  [SMD RES 0402]
TP300  TESTPOINT SMD  [TESTPOINT 0.5mm DIA]  (value not drawn)  (no BOM)
TP301  TESTPOINT SMD  [TESTPOINT 0.5mm DIA]  (value not drawn)  (no BOM)
TP302  TESTPOINT SMD  [TESTPOINT 0.5mm DIA]  (value not drawn)  (no BOM)
TP303  TESTPOINT SMD  [TESTPOINT 0.5mm DIA]  (value not drawn)  (no BOM)
TP304  TESTPOINT SMD  [TESTPOINT 0.5mm DIA]  (value not drawn)  (no BOM)
TP305  TESTPOINT SMD  [TESTPOINT 0.5mm DIA]  (value not drawn)  (no BOM)
TP306  TESTPOINT SMD  [TESTPOINT 0.5mm DIA]  (value not drawn)  (no BOM)
TP307  TESTPOINT SMD  [TESTPOINT 1mm DIA]  (value not drawn)  (no BOM)
U300  MAX-M8C  [MAX-M8]

### Ports
GPS_EXTINT, GPS_RESETN (in), GPS_RXD (out), GPS_SCL (in), GPS_SDA (bidir), GPS_TIME (out), GPS_TXD (in)

### Nets
GND: C300.2 C301.1 C302.2 C303.1 C305.2 J300.2(GND) J300.3(GND) TP307.1 U300.1(GND) U300.10(GND) U300.12(GND)
V3_3D: R300.1 R302.1
V_GPS_IO: C300.1 C301.2 L300.2 R303.1 R304.1 U300.7(VCC_IO)
V_GPS_RF: R305.1 U300.14(VCC_RF)
V_GPS_VCC: C302.1 C303.2 L301.2 U300.6(V_BCKP) U300.8(VCC)
VDD_ANT_3V0: C305.1 L303.2 R305.2
GPS_EXTINT: L307.1 ; port GPS_EXTINT
GPS_RESETN: L309.1 ; port GPS_RESETN
GPS_RF_IN: J300.1 L303.1 U300.11(RF_IN)
GPS_RXD: L305.1 ; port GPS_RXD
GPS_SCL: L304.1 ; port GPS_SCL
GPS_SDA: L302.1 ; port GPS_SDA
GPS_TIME: L308.1 ; port GPS_TIME
GPS_TXD: L306.1 ; port GPS_TXD
MAX-M8_EXTINT: L307.2 TP304.1 U300.5(EXTINT)
MAX-M8_RESETN: L309.2 TP306.1 U300.9(RESET_N)
MAX-M8_RXD: L306.2 TP303.1 U300.3(RXD)
MAX-M8_SCL: L304.2 R304.2 TP301.1 U300.17(SCL)
MAX-M8_SDA: L302.2 R303.2 TP300.1 U300.16(SDA)
MAX-M8_TIME: L308.2 TP305.1 U300.4(TIMEPULSE)
MAX-M8_TXD: L305.2 TP302.1 U300.2(TXD)
NetL300_1: L300.1 R300.2
NetL301_1: L301.1 R302.2

Not connected (* = marked no-connect by the designer): U300 13(LNA_EN)* 15(RSVD)* 18(SAFEBOOT_N)*

### Notes on the sheet
- Active antenna connection

### Library data of the parts
C300 C302 = CAP MLCC SMD: as C204 on sheet QCLogic Rev A Sht2 WiFi; 3. Date Modified: 20200906
C301 C303 = CAP MLCC SMD: as C100 on sheet QCLogic Rev A Sht1 MCU IO; 3. Date Modified: 20201122
C305 = CAP MLCC SMD: CAP CER 10000PF 16V X7R 0402; 1. Manufacturer: Walsin Technology Corporation; 2. Manufacturer Part Number: 0402B103K160CT; 4. Package: 0402; 3. Date Modified: 20201122
J300 = CONN UMCC MICRO-COAX RECEPTACLE, GEN: 1. Manufacturer: TE Connectivity AMP Connectors; 2. Manufacturer Part Number: 2337019-1; 3. Date Modified: 20201122
L300-L302 L304-L309 = INDUCTOR: FERRITE BEAD 1 KOHM 0402 1LN; 1. Manufacturer: Murata Electronics; 2. Manufacturer Part Number: BLM15HD102SN1D; 3. Date Modified: 20201122
L303 = INDUCTOR: IND 27NH 350MA 460 MOHM; 1. Manufacturer: Murata Electronics; 2. Manufacturer Part Number: LQG15HS27NJ02D; 3. Date Modified: 20201122
R300 R302 = RES SMD: as R100 on sheet QCLogic Rev A Sht1 MCU IO; 3. Date Modified: 20201122
R303 R304 = RES SMD: RES SMD 2.2K OHM 1% 1/16W 0402; 1. Manufacturer: Yageo; 2. Manufacturer Part Number: RC0402FR-072K2L; 4. Package: 0402; 3. Date Modified: 20201126
R305 = RES SMD: RES SMD 10 OHM 5% 1/16W 0402; 1. Manufacturer: Yageo; 2. Manufacturer Part Number: RC0402JR-0710RL; 4. Package: 0402; 3. Date Modified: 20200906
TP300-TP307 = TESTPOINT PAD: TESTPOINT SMD PAD; 1. Manufacturer: *; 2. Manufacturer Part Number: *; 3. Date Modified: *
U300 = MODULE RF RCVR GNSS/GPS 1.575GHZ 18LCC: 1. Manufacturer: U-Blox; 2. Manufacturer Part Number: MAX-M8C-0; 3. Date Modified: 20201122

## Sheet QCLogic Rev A Sht4 QSPI Flash.SchDoc
size A4
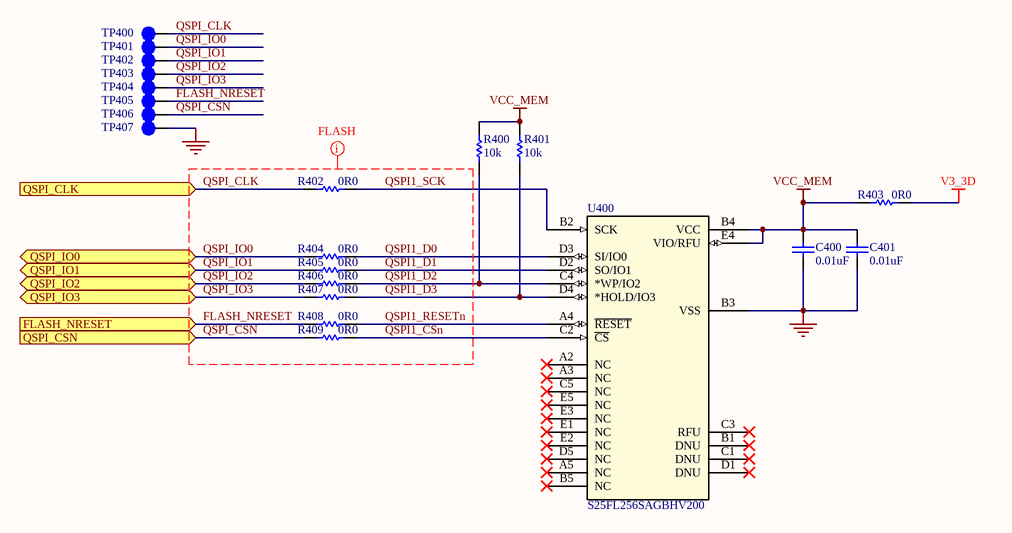
[diagram p4: QCLogic Rev A Sht4 QSPI Flash.SchDoc]

### Parts
C400  0.01uF  [SMD CAP 0402]
C401  0.01uF  [SMD CAP 0402]
R400  10k  [SMD RES 0402]
R401  10k  [SMD RES 0402]
R402  0R0  [SMD RES 0402]
R403  0R0  [SMD RES 0402]
R404  0R0  [SMD RES 0402]
R405  0R0  [SMD RES 0402]
R406  0R0  [SMD RES 0402]
R407  0R0  [SMD RES 0402]
R408  0R0  [SMD RES 0402]
R409  0R0  [SMD RES 0402]
TP400  TESTPOINT SMD  [TESTPOINT 0.5mm DIA]  (value not drawn)  (no BOM)
TP401  TESTPOINT SMD  [TESTPOINT 0.5mm DIA]  (value not drawn)  (no BOM)
TP402  TESTPOINT SMD  [TESTPOINT 0.5mm DIA]  (value not drawn)  (no BOM)
TP403  TESTPOINT SMD  [TESTPOINT 0.5mm DIA]  (value not drawn)  (no BOM)
TP404  TESTPOINT SMD  [TESTPOINT 0.5mm DIA]  (value not drawn)  (no BOM)
TP405  TESTPOINT SMD  [TESTPOINT 0.5mm DIA]  (value not drawn)  (no BOM)
TP406  TESTPOINT SMD  [TESTPOINT 0.5mm DIA]  (value not drawn)  (no BOM)
TP407  TESTPOINT SMD  [TESTPOINT 0.5mm DIA]  (value not drawn)  (no BOM)
U400  S25FL256SAGBHV200  [TFBGA-24 8x6]

### Ports
FLASH_NRESET (in), QSPI_CLK (in), QSPI_CSN (in), QSPI_IO0 (bidir), QSPI_IO1 (bidir), QSPI_IO2 (bidir), QSPI_IO3 (bidir)

### Nets
GND: C400.2 C401.2 TP407.1 U400.B3(VSS)
V3_3D: R403.2
VCC_MEM: C400.1 C401.1 R400.1 R401.1 R403.1 U400.B4(VCC) U400.E4(VIO/RFU)
FLASH_NRESET: R408.1 TP405.1 ; port FLASH_NRESET
QSPI1_CSn: R409.2 U400.C2(~{CS})
QSPI1_D0: R404.2 U400.D3(SI/IO0)
QSPI1_D1: R405.2 U400.D2(SO/IO1)
QSPI1_D2: R400.2 R406.2 U400.C4(*WP/IO2)
QSPI1_D3: R401.2 R407.2 U400.D4(*HOLD/IO3)
QSPI1_RESETn: R408.2 U400.A4(~{RESET})
QSPI1_SCK: R402.2 U400.B2(SCK)
QSPI_CLK: R402.1 TP400.1 ; port QSPI_CLK
QSPI_CSN: R409.1 TP406.1 ; port QSPI_CSN
QSPI_IO0: R404.1 TP401.1 ; port QSPI_IO0
QSPI_IO1: R405.1 TP402.1 ; port QSPI_IO1
QSPI_IO2: R406.1 TP403.1 ; port QSPI_IO2
QSPI_IO3: R407.1 TP404.1 ; port QSPI_IO3

Not connected (* = marked no-connect by the designer): U400 A2(NC)* A3(NC)* A5(NC)* B1(DNU)* B5(NC)* C1(DNU)* C3(RFU)* C5(NC)* D1(DNU)* D5(NC)* E1(NC)* E2(NC)* E3(NC)* E5(NC)*

### Layout directives
net class FLASH: FLASH_NRESET, QSPI1_CSn, QSPI1_D0, QSPI1_D1, QSPI1_D2, QSPI1_D3, QSPI1_RESETn, QSPI1_SCK, QSPI_CLK, QSPI_CSN, QSPI_IO0, QSPI_IO1, QSPI_IO2, QSPI_IO3

### Library data of the parts
C400 C401 = CAP MLCC SMD: as C305 on sheet QCLogic Rev A Sht3 GPS; 3. Date Modified: 20201122
R400 R401 = RES SMD: RES SMD 10K OHM 1% 1/16W 0402; 1. Manufacturer: Yageo; 2. Manufacturer Part Number: RC0402FR-0710KL; 4. Package: 0402; 3. Date Modified: 20201126
R402-R409 = RES SMD: as R100 on sheet QCLogic Rev A Sht1 MCU IO; 3. Date Modified: 20201122
TP400-TP407 = TESTPOINT PAD: TESTPOINT SMD PAD; 1. Manufacturer: *; 2. Manufacturer Part Number: *; 3. Date Modified: *
U400 = IC FLASH 256M SPI 133MHZ 24BGA: 1. Manufacturer: Cypress Semiconductor Corp; 2. Manufacturer Part Number: S25FL256SAGBHV200; 3. Date Modified: 20200909

## Sheet QCLogic Rev A Sht5 MEMS.SchDoc
size A4
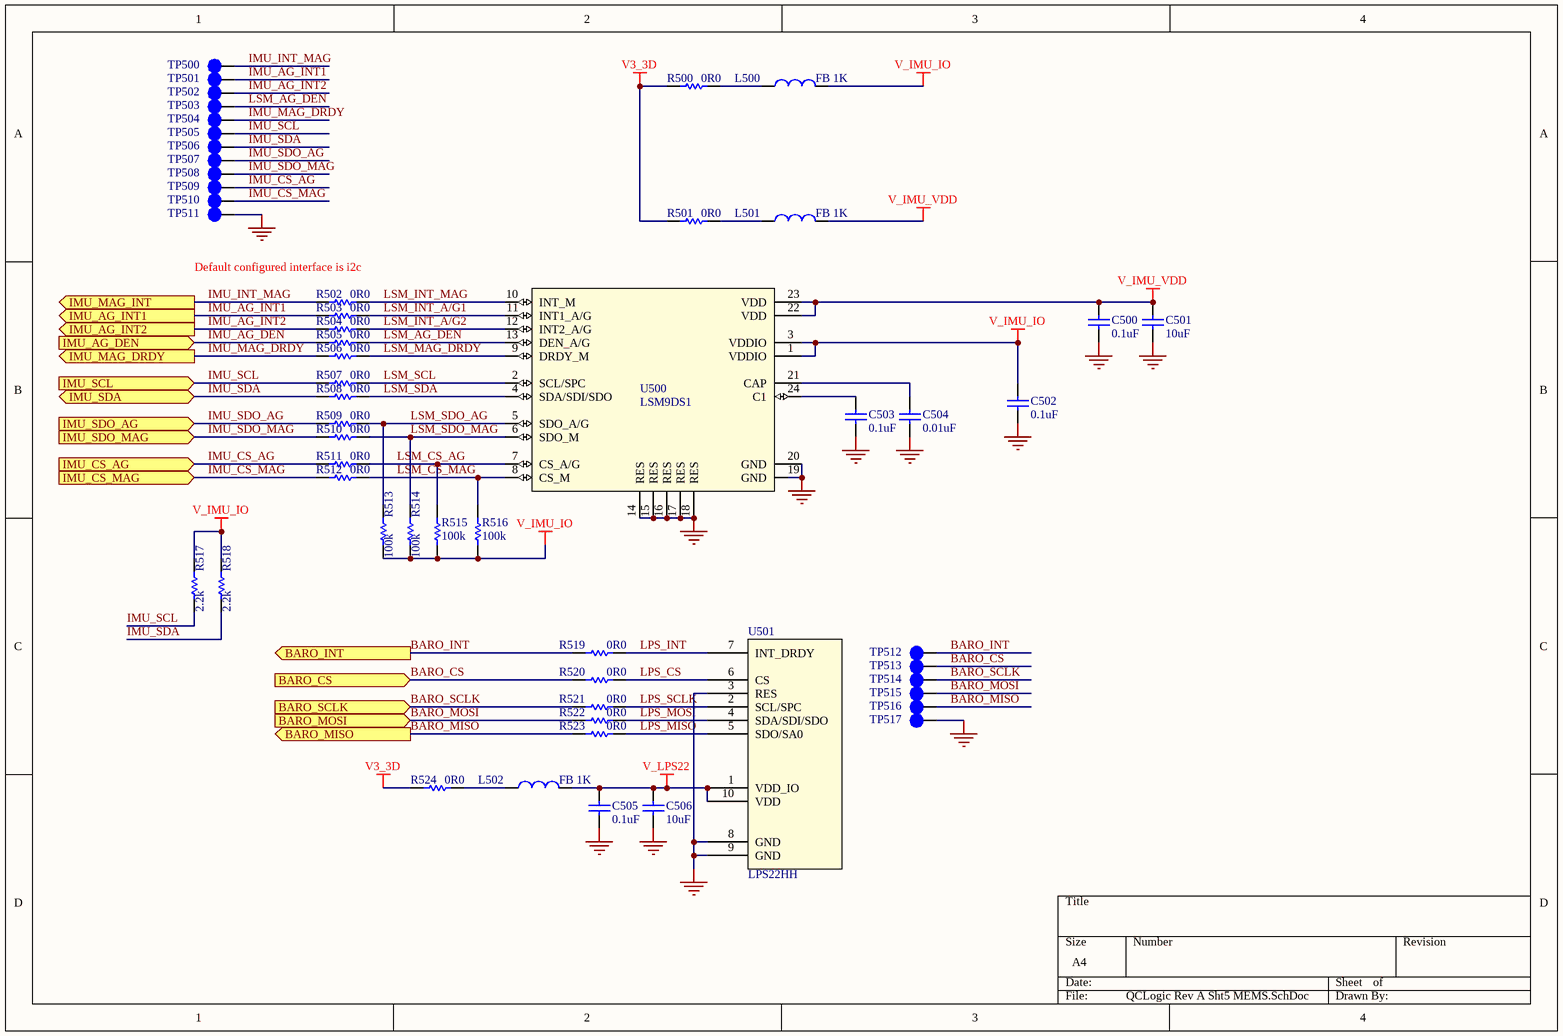
[diagram p5: QCLogic Rev A Sht5 MEMS.SchDoc]

### Parts
C500  0.1uF  [SMD CAP 0402]
C501  10uF  [SMD CAP 0805]
C502  0.1uF  [SMD CAP 0402]
C503  0.1uF  [SMD CAP 0402]
C504  0.01uF  [SMD CAP 0402]
C505  0.1uF  [SMD CAP 0402]
C506  10uF  [SMD CAP 0805]
L500  FB 1K  [SMD RES 0402]
L501  FB 1K  [SMD RES 0402]
L502  FB 1K  [SMD RES 0402]
R500  0R0  [SMD RES 0402]
R501  0R0  [SMD RES 0402]
R502  0R0  [SMD RES 0402]
R503  0R0  [SMD RES 0402]
R504  0R0  [SMD RES 0402]
R505  0R0  [SMD RES 0402]
R506  0R0  [SMD RES 0402]
R507  0R0  [SMD RES 0402]
R508  0R0  [SMD RES 0402]
R509  0R0  [SMD RES 0402]
R510  0R0  [SMD RES 0402]
R511  0R0  [SMD RES 0402]
R512  0R0  [SMD RES 0402]
R513  100k  [SMD RES 0402]
R514  100k  [SMD RES 0402]
R515  100k  [SMD RES 0402]
R516  100k  [SMD RES 0402]
R517  2.2k  [SMD RES 0402]
R518  2.2k  [SMD RES 0402]
R519  0R0  [SMD RES 0402]
R520  0R0  [SMD RES 0402]
R521  0R0  [SMD RES 0402]
R522  0R0  [SMD RES 0402]
R523  0R0  [SMD RES 0402]
R524  0R0  [SMD RES 0402]
TP500  TESTPOINT SMD  [TESTPOINT 0.5mm DIA]  (value not drawn)  (no BOM)
TP501  TESTPOINT SMD  [TESTPOINT 0.5mm DIA]  (value not drawn)  (no BOM)
TP502  TESTPOINT SMD  [TESTPOINT 0.5mm DIA]  (value not drawn)  (no BOM)
TP503  TESTPOINT SMD  [TESTPOINT 0.5mm DIA]  (value not drawn)  (no BOM)
TP504  TESTPOINT SMD  [TESTPOINT 0.5mm DIA]  (value not drawn)  (no BOM)
TP505  TESTPOINT SMD  [TESTPOINT 0.5mm DIA]  (value not drawn)  (no BOM)
TP506  TESTPOINT SMD  [TESTPOINT 0.5mm DIA]  (value not drawn)  (no BOM)
TP507  TESTPOINT SMD  [TESTPOINT 0.5mm DIA]  (value not drawn)  (no BOM)
TP508  TESTPOINT SMD  [TESTPOINT 0.5mm DIA]  (value not drawn)  (no BOM)
TP509  TESTPOINT SMD  [TESTPOINT 0.5mm DIA]  (value not drawn)  (no BOM)
TP510  TESTPOINT SMD  [TESTPOINT 0.5mm DIA]  (value not drawn)  (no BOM)
TP511  TESTPOINT SMD  [TESTPOINT 1mm DIA]  (value not drawn)  (no BOM)
TP512  TESTPOINT SMD  [TESTPOINT 0.5mm DIA]  (value not drawn)  (no BOM)
TP513  TESTPOINT SMD  [TESTPOINT 0.5mm DIA]  (value not drawn)  (no BOM)
TP514  TESTPOINT SMD  [TESTPOINT 0.5mm DIA]  (value not drawn)  (no BOM)
TP515  TESTPOINT SMD  [TESTPOINT 0.5mm DIA]  (value not drawn)  (no BOM)
TP516  TESTPOINT SMD  [TESTPOINT 0.5mm DIA]  (value not drawn)  (no BOM)
TP517  TESTPOINT SMD  [TESTPOINT 0.5mm DIA]  (value not drawn)  (no BOM)
U500  LSM9DS1  [LGA-24]
U501  LPS22HH  [LGA-10]

### Ports
BARO_CS (in), BARO_INT (out), BARO_MISO (out), BARO_MOSI (in), BARO_SCLK (in), IMU_AG_DEN (in), IMU_AG_INT1 (out), IMU_AG_INT2 (out), IMU_CS_AG (in), IMU_CS_MAG (in), IMU_MAG_DRDY (out), IMU_MAG_INT (out), IMU_SCL (in), IMU_SDA (bidir), IMU_SDO_AG (in), IMU_SDO_MAG (in)

### Nets
GND: C500.1 C501.2 C502.1 C503.1 C504.2 C505.1 C506.2 TP511.1 TP517.1 U500.14(RES) U500.15(RES) U500.16(RES) U500.17(RES) U500.18(RES) U500.19(GND) U500.20(GND) U501.3(RES) U501.8(GND) U501.9(GND)
V3_3D: R500.1 R501.1 R524.1
V_IMU_IO: C502.2 L500.2 R513.2 R514.2 R515.2 R516.2 R517.1 R518.1 U500.1(VDDIO) U500.3(VDDIO)
V_IMU_VDD: C500.2 C501.1 L501.2 U500.22(VDD) U500.23(VDD)
V_LPS22: C505.2 C506.1 L502.2 U501.1(VDD_IO) U501.10(VDD)
BARO_CS: R520.1 TP513.1 ; port BARO_CS
BARO_INT: R519.1 TP512.1 ; port BARO_INT
BARO_MISO: R523.1 TP516.1 ; port BARO_MISO
BARO_MOSI: R522.1 TP515.1 ; port BARO_MOSI
BARO_SCLK: R521.1 TP514.1 ; port BARO_SCLK
IMU_AG_DEN: R505.1 ; port IMU_AG_DEN
IMU_AG_INT1: R503.1 TP501.1 ; port IMU_AG_INT1
IMU_AG_INT2: R504.1 TP502.1 ; port IMU_AG_INT2
IMU_CS_AG: R511.1 TP509.1 ; port IMU_CS_AG
IMU_CS_MAG: R512.1 TP510.1 ; port IMU_CS_MAG
IMU_INT_MAG: R502.1 TP500.1 ; port IMU_MAG_INT
IMU_MAG_DRDY: R506.1 TP504.1 ; port IMU_MAG_DRDY
IMU_SCL: R507.1 R517.2 TP505.1 ; port IMU_SCL
IMU_SDA: R508.1 R518.2 TP506.1 ; port IMU_SDA
IMU_SDO_AG: R509.1 TP507.1 ; port IMU_SDO_AG
IMU_SDO_MAG: R510.1 TP508.1 ; port IMU_SDO_MAG
LPS_CS: R520.2 U501.6(CS)
LPS_INT: R519.2 U501.7(INT_DRDY)
LPS_MISO: R523.2 U501.5(SDO/SA0)
LPS_MOSI: R522.2 U501.4(SDA/SDI/SDO)
LPS_SCLK: R521.2 U501.2(SCL/SPC)
LSM_AG_DEN: R505.2 TP503.1 U500.13(DEN_A/G)
LSM_CS_AG: R511.2 R515.1 U500.7(CS_A/G)
LSM_CS_MAG: R512.2 R516.1 U500.8(CS_M)
LSM_INT_A/G1: R503.2 U500.11(INT1_A/G)
LSM_INT_A/G2: R504.2 U500.12(INT2_A/G)
LSM_INT_MAG: R502.2 U500.10(INT_M)
LSM_MAG_DRDY: R506.2 U500.9(DRDY_M)
LSM_SCL: R507.2 U500.2(SCL/SPC)
LSM_SDA: R508.2 U500.4(SDA/SDI/SDO)
LSM_SDO_AG: R509.2 R513.1 U500.5(SDO_A/G)
LSM_SDO_MAG: R510.2 R514.1 U500.6(SDO_M)
NetC503_2: C503.2 U500.24(C1)
NetC504_1: C504.1 U500.21(CAP)
NetL500_1: L500.1 R500.2
NetL501_1: L501.1 R501.2
NetL502_1: L502.1 R524.2

### Notes on the sheet
- Default configured interface is i2c

### Library data of the parts
C500 C502 C503 C505 = CAP MLCC SMD: as C100 on sheet QCLogic Rev A Sht1 MCU IO; 3. Date Modified: 20201122
C501 C506 = CAP MLCC SMD: as C201 on sheet QCLogic Rev A Sht2 WiFi; 3. Date Modified: 20201128
C504 = CAP MLCC SMD: as C305 on sheet QCLogic Rev A Sht3 GPS; 3. Date Modified: 20201122
L500-L502 = INDUCTOR: as L300 on sheet QCLogic Rev A Sht3 GPS; 3. Date Modified: 20201122
R500-R512 R519-R524 = RES SMD: as R100 on sheet QCLogic Rev A Sht1 MCU IO; 3. Date Modified: 20201122
R513-R516 = RES SMD: as R113 on sheet QCLogic Rev A Sht1 MCU IO; 3. Date Modified: 20201126
R517 R518 = RES SMD: as R303 on sheet QCLogic Rev A Sht3 GPS; 3. Date Modified: 20201126
TP500-TP517 = TESTPOINT PAD: TESTPOINT SMD PAD; 1. Manufacturer: *; 2. Manufacturer Part Number: *; 3. Date Modified: *
U500 = IC IMU ACCEL/GYRO/MAG I2C/SPI 24LGA LSM9DS1: IMU ACCEL/GYRO/MAG I2C/SPI 24LGA LSM9DS1; 1. Manufacturer: STMicroelectronics; 2. Manufacturer Part Number: LSM9DS1TR; 3. Date Modified: 20201122
U501 = IC BARO PRESSURE SENSOR LPS22HH: 1. Manufacturer: STMicroelectronics; 2. Manufacturer Part Number: LPS22HHTR; 3. Date Modified: 20201122

## Sheet QCLogic Rev A Sht6 Connector.SchDoc
size A4
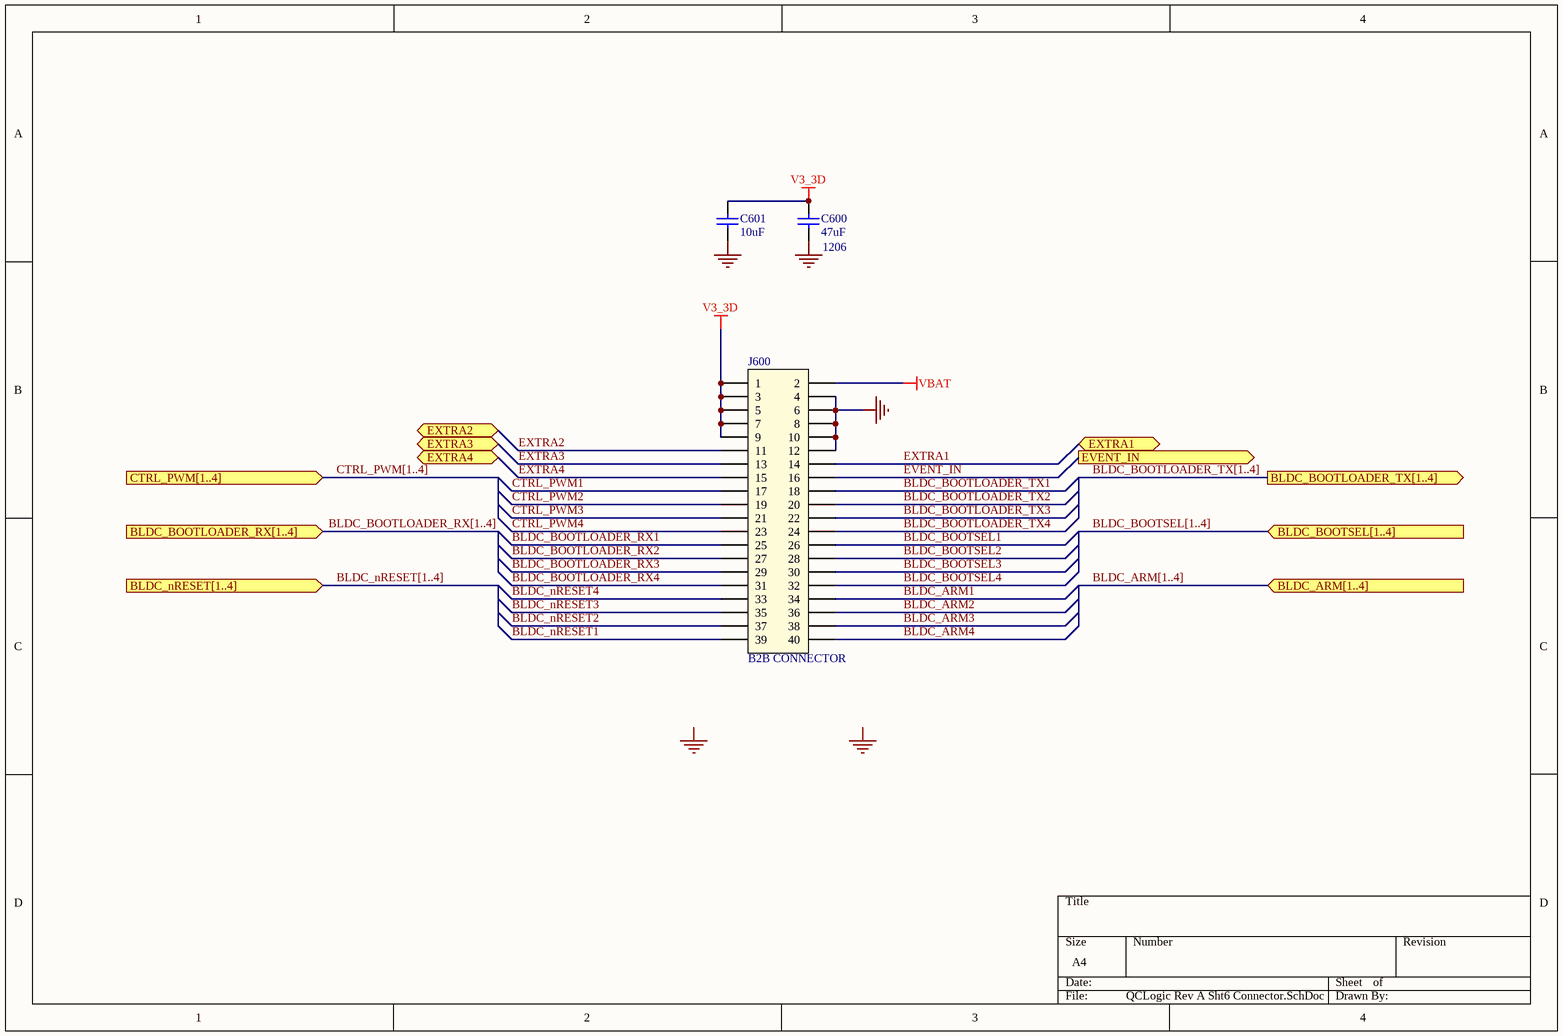
[diagram p6: QCLogic Rev A Sht6 Connector.SchDoc]

### Parts
C600  47uF  4. Package: 1206  [SMD CAP 1206]
C601  10uF  [SMD CAP 0805]
J600  B2B CONNECTOR  [CONN B2B RECPT 40POS SMD GOLD]

### Ports
BLDC_ARM[1..4] (in), BLDC_BOOTLOADER_RX[1..4] (in), BLDC_BOOTLOADER_TX[1..4] (out), BLDC_BOOTSEL[1..4] (in), BLDC_nRESET[1..4] (in), CTRL_PWM[1..4] (in), EVENT_IN (out), EXTRA1 (bidir), EXTRA2 (bidir), EXTRA3 (bidir), EXTRA4 (bidir)

### Nets
GND: C600.2 C601.2 J600.4 J600.6 J600.8 J600.10 J600.12
V3_3D: C600.1 C601.1 J600.1 J600.3 J600.5 J600.7 J600.9
VBAT: J600.2
BLDC_ARM1: J600.34
BLDC_ARM2: J600.36
BLDC_ARM3: J600.38
BLDC_ARM4: J600.40
BLDC_BOOTLOADER_RX1: J600.25
BLDC_BOOTLOADER_RX2: J600.27
BLDC_BOOTLOADER_RX3: J600.29
BLDC_BOOTLOADER_RX4: J600.31
BLDC_BOOTLOADER_TX1: J600.18
BLDC_BOOTLOADER_TX2: J600.20
BLDC_BOOTLOADER_TX3: J600.22
BLDC_BOOTLOADER_TX4: J600.24
BLDC_BOOTSEL1: J600.26
BLDC_BOOTSEL2: J600.28
BLDC_BOOTSEL3: J600.30
BLDC_BOOTSEL4: J600.32
BLDC_nRESET1: J600.39
BLDC_nRESET2: J600.37
BLDC_nRESET3: J600.35
BLDC_nRESET4: J600.33
CTRL_PWM1: J600.17
CTRL_PWM2: J600.19
CTRL_PWM3: J600.21
CTRL_PWM4: J600.23
EVENT_IN: J600.16 ; port EVENT_IN
EXTRA1: J600.14 ; port EXTRA1
EXTRA2: J600.11 ; port EXTRA2
EXTRA3: J600.13 ; port EXTRA3
EXTRA4: J600.15 ; port EXTRA4

### Buses and harness runs
bus BLDC_ARM[1..4] = port BLDC_ARM[1..4]
bus BLDC_BOOTLOADER_RX[1..4] = port BLDC_BOOTLOADER_RX[1..4]
bus BLDC_BOOTLOADER_TX[1..4] = port BLDC_BOOTLOADER_TX[1..4]
bus BLDC_BOOTSEL[1..4] = port BLDC_BOOTSEL[1..4]
bus BLDC_nRESET[1..4] = port BLDC_nRESET[1..4]
bus CTRL_PWM[1..4] = port CTRL_PWM[1..4]

### Notes on the sheet
- Labels drawn without touching a wire or pin: GND

### Library data of the parts
C600 = CAP MLCC SMD: as C200 on sheet QCLogic Rev A Sht2 WiFi; 3. Date Modified: 20201128
C601 = CAP MLCC SMD: as C201 on sheet QCLogic Rev A Sht2 WiFi; 3. Date Modified: 20201128
J600 = CONN B2B RCPT 40POS SMD GOLD: 40 Position Connector Receptacle, Outer Shroud Contacts Surface Mount Gold; 1. Manufacturer: Amphenol ICC (FCI); 2. Manufacturer Part Number: 10144517-041802LF; 3. Date Modified: 20201130

## Sheet QCLogic Rev A Sht7 MCU CTRL.SchDoc
size A4
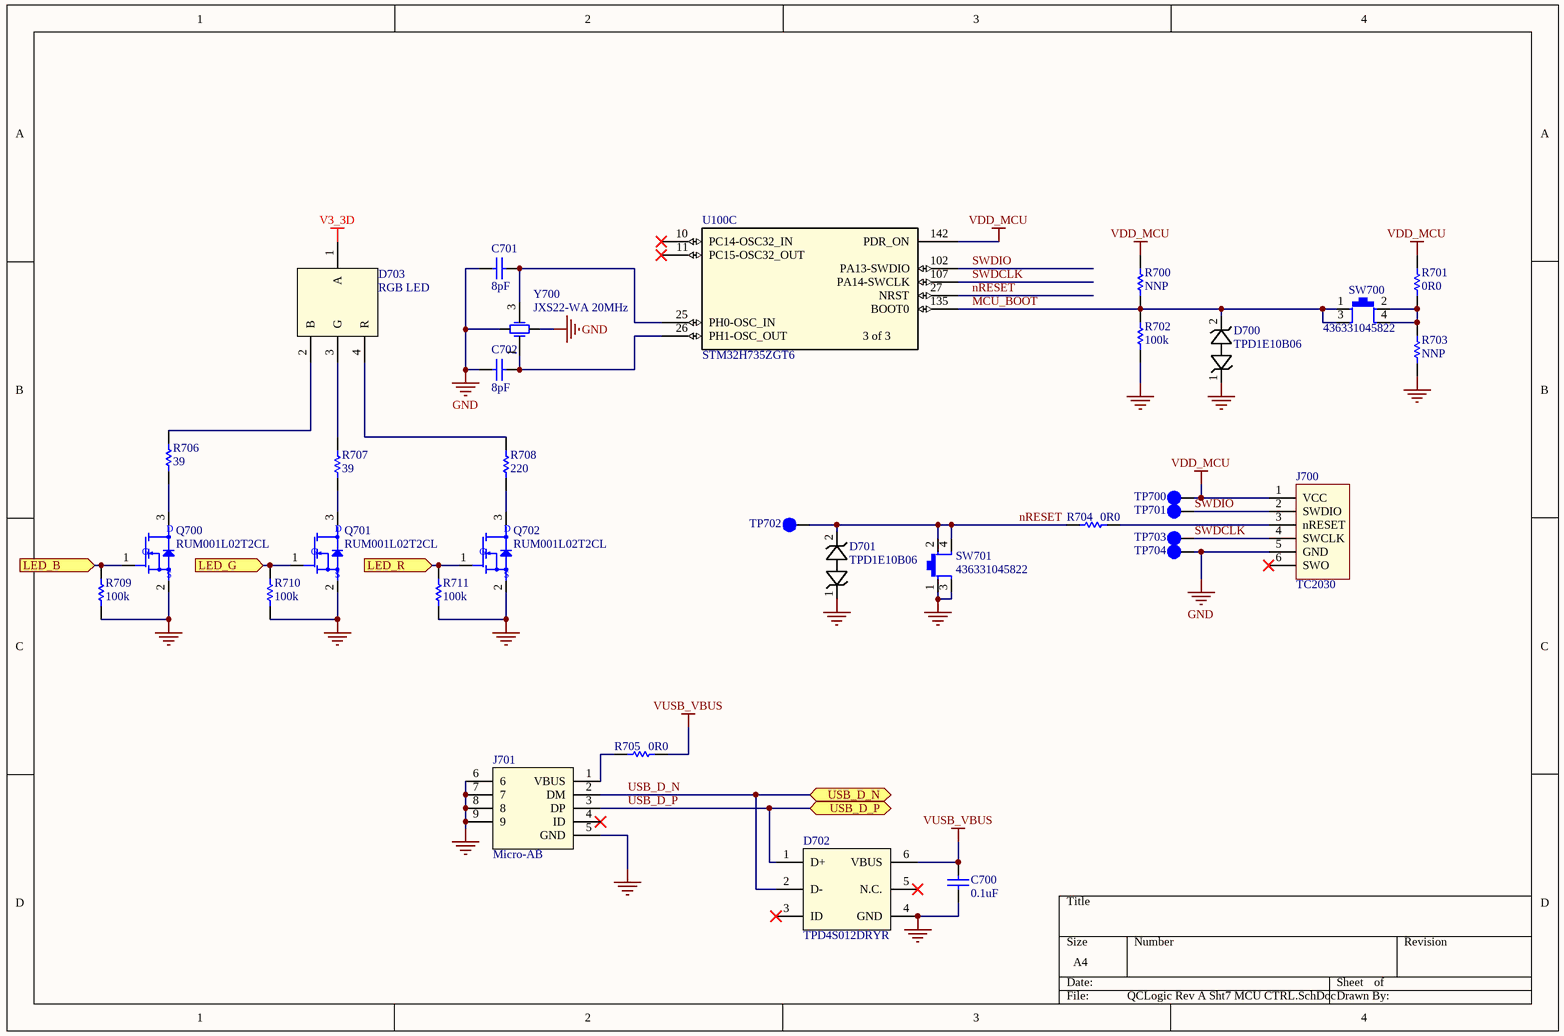
[diagram p7: QCLogic Rev A Sht7 MCU CTRL.SchDoc]

### Parts
C700  0.1uF  [SMD CAP 0402]
C701  8pF  [SMD CAP 0402]
C702  8pF  [SMD CAP 0402]
D700  TPD1E10B06  [DIODE 0402 2-X1SON]
D701  TPD1E10B06  [DIODE 0402 2-X1SON]
D702  TPD4S012DRYR  [SON-6 1.45x1]
D703  RGB LED  [PLCC-4 LED ASMB-MTB0-0A3A2]
J700  TC2030  [tag-connect-6]
J701  Micro-AB  [CONN USB MICRO_AB]
Q700  RUM001L02T2CL  [SOT-723]
Q701  RUM001L02T2CL  [SOT-723]
Q702  RUM001L02T2CL  [SOT-723]
R700  NNP  [SMD RES 0402]  (no BOM)
R701  0R0  [SMD RES 0402]
R702  100k  [SMD RES 0402]
R703  NNP  [SMD RES 0402]  (no BOM)
R704  0R0  [SMD RES 0402]
R705  0R0  [SMD RES 0402]
R706  39  [SMD RES 0402]
R707  39  [SMD RES 0402]
R708  220  [SMD RES 0402]
R709  100k  [SMD RES 0402]
R710  100k  [SMD RES 0402]
R711  100k  [SMD RES 0402]
SW700  436331045822  [BUTTON 436331045822]
SW701  436331045822  [BUTTON 436331045822]
TP700  TESTPOINT SMD  [TESTPOINT 1mm DIA]  (value not drawn)  (no BOM)
TP701  TESTPOINT SMD  [TESTPOINT 1mm DIA]  (value not drawn)  (no BOM)
TP702  TESTPOINT SMD  [TESTPOINT 1mm DIA]  (value not drawn)  (no BOM)
TP703  TESTPOINT SMD  [TESTPOINT 1mm DIA]  (value not drawn)  (no BOM)
TP704  TESTPOINT SMD  [TESTPOINT 1mm DIA]  (value not drawn)  (no BOM)
U100  STM32H735ZGT6  [LQFP-144 20x20]  (part C of 3)
Y700  JXS22-WA 20MHz  [XTAL JXS22-WA]

### Ports
LED_B (in), LED_G (in), LED_R (in), USB_D_N (bidir), USB_D_P (bidir)

### Nets
GND: C700.1 C701.2 C702.2 D700.1 D701.1 D702.4(GND) J700.5(GND) J701.5(GND) J701.6 J701.7 J701.8 J701.9 Q700.2 Q701.2 Q702.2 R702.2 R703.2 R709.2 R710.2 R711.2 SW701.1 SW701.3 TP704.1 Y700.2 Y700.4
V3_3D: D703.1(A)
VDD_MCU: J700.1(VCC) R700.1 R701.1 TP700.1 U100.142(PDR_ON)
VUSB_VBUS: C700.2 D702.6(VBUS) R705.2
LED_B: Q700.1(G) R709.1 ; port LED_B
LED_G: Q701.1(G) R710.1 ; port LED_G
LED_R: Q702.1(G) R711.1 ; port LED_R
MCU_BOOT: D700.2 R700.2 R702.1 SW700.1 SW700.3 U100.135(BOOT0)
nRESET: D701.2 R704.1 SW701.2 SW701.4 TP702.1 U100.27(NRST)
SWDCLK: J700.4(SWCLK) TP703.1 U100.107(PA14-SWCLK)
SWDIO: J700.2(SWDIO) TP701.1 U100.102(PA13-SWDIO)
USB_D_N: D702.2(D-) J701.2(DM) ; port USB_D_N
USB_D_P: D702.1(D+) J701.3(DP) ; port USB_D_P
NetC701_1: C701.1 U100.25(PH0-OSC_IN) Y700.3
NetC702_1: C702.1 U100.26(PH1-OSC_OUT) Y700.1
NetD703_2: D703.2(B) R706.2
NetD703_3: D703.3(G) R707.2
NetD703_4: D703.4(R) R708.2
NetJ700_3: J700.3(nRESET) R704.2
NetJ701_1: J701.1(VBUS) R705.1
NetQ700_3: Q700.3 R706.1
NetQ701_3: Q701.3 R707.1
NetQ702_3: Q702.3 R708.1
NetR701_2: R701.2 R703.1 SW700.2 SW700.4

Not connected (* = marked no-connect by the designer): D702 3(ID)* 5(N.C.)*; J700 6(SWO)*; J701 4(ID)*; U100 10(PC14-OSC32_IN)* 11(PC15-OSC32_OUT)*

### Notes on the sheet
- (in symbol IC MCU STM32H735ZG Arm M7, part C) 3 of 3
- (in symbol TRANS FET N-CH 20V 0.1A SOT-723 RUM001L02T2CL) D; S

### Library data of the parts
C700 = CAP MLCC SMD: as C100 on sheet QCLogic Rev A Sht1 MCU IO; 3. Date Modified: 20201122
C701 C702 = CAP MLCC SMD: CAP CER 8PF 50V C0G/NP0 0402; 1. Manufacturer: Samsung Electro-Mechanics; 2. Manufacturer Part Number: CL05C080CB5NNNC; 4. Package: 0402; 3. Date Modified: 20201127
D700 D701 = DIODE TVS DIODE 5.5V 14V 2X1SON: 1. Manufacturer: Texas Instruments; 2. Manufacturer Part Number: TPD1E10B06DPYR; 3. Date Modified: 20200805
D702 = DIODE TVS 4CH 5.5V 6SON: 1. Manufacturer: Texas Instruments; 2. Manufacturer Part Number: TPD4S012DRYR; 3. Date Modified: 20200910
D703 = LED RGB DIFFUSED 4PLCC SMD: 1. Manufacturer: Broadcom Limited; 2. Manufacturer Part Number: ASMB-MTB0-0A3A2; 3. Date Modified: 20201125
J700 = TC2030: TC2030 PGM PADS; 1. Manufacturer: NA; 2. Manufacturer Part Number: NA
J701 = CONN RCPT USB2.0 MICRO AB SMD RA: 1. Manufacturer: Hirose Electric Co Ltd; 2. Manufacturer Part Number: ZX62-AB-5PA(31); 3. Date Modified: 20200821
Q700-Q702 = TRANS FET N-CH 20V 0.1A SOT-723 RUM001L02T2CL: 1. Manufacturer: Rohm Semiconductor; 2. Manufacturer Part Number: RUM001L02T2CL; 3. Date Modified: 20200911
R700 R702 R709-R711 = RES SMD: as R113 on sheet QCLogic Rev A Sht1 MCU IO; 3. Date Modified: 20201126
R701 R703-R705 = RES SMD: as R100 on sheet QCLogic Rev A Sht1 MCU IO; 3. Date Modified: 20201122
R706 R707 = RES SMD: RES SMD 39 OHM 5% 1/16W 0402; 1. Manufacturer: Yageo; 2. Manufacturer Part Number: RC0402JR-0739RL; 4. Package: 0402; 3. Date Modified: 20201125
R708 = RES SMD: RES SMD 220 OHM 5% 1/16W 0402; 1. Manufacturer: Yageo; 2. Manufacturer Part Number: RC0402JR-07220RL; 4. Package: 0402; 3. Date Modified: 20201125
SW700 SW701 = SWITCH R/A TACTILE SPST-NO 0.05A 12V: 1. Manufacturer: Würth Elektronik; 2. Manufacturer Part Number: 436331045822; 3. Date Modified: 20201127
TP700-TP704 = TESTPOINT PAD: TESTPOINT SMD PAD; 1. Manufacturer: *; 2. Manufacturer Part Number: *; 3. Date Modified: *
U100 = IC MCU STM32H735ZG Arm M7: as U100 on sheet QCLogic Rev A Sht1 MCU IO; 2. Manufacturer Part Number: STM32H735ZGT6; 3. Date Modified: 20201126
Y700 = XTAL JXS22-WA 20MHz 10PF SMD: 1. Manufacturer: Jauch Quartz; 2. Manufacturer Part Number: Q 20,0-JXS22-10-10/15-T1-FU-WA-LF; 3. Date Modified: 20200811

## Sheet QCLogic Rev A Sht8 MCU Power.SchDoc
size A4
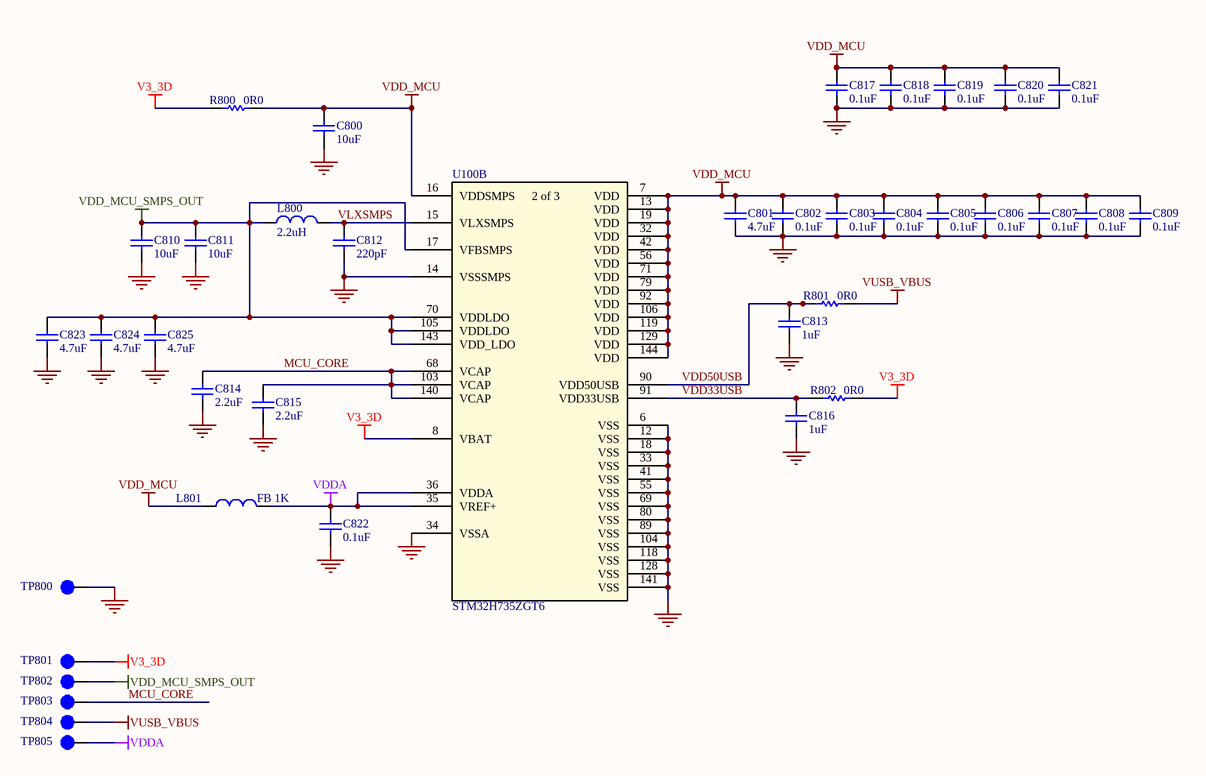
[diagram p8: QCLogic Rev A Sht8 MCU Power.SchDoc]

### Parts
C800  10uF  [SMD CAP 0805]
C801  4.7uF  [SMD CAP 0603]
C802  0.1uF  [SMD CAP 0402]
C803  0.1uF  [SMD CAP 0402]
C804  0.1uF  [SMD CAP 0402]
C805  0.1uF  [SMD CAP 0402]
C806  0.1uF  [SMD CAP 0402]
C807  0.1uF  [SMD CAP 0402]
C808  0.1uF  [SMD CAP 0402]
C809  0.1uF  [SMD CAP 0402]
C810  10uF  [SMD CAP 0805]
C811  10uF  [SMD CAP 0805]
C812  220pF  [SMD CAP 0402]
C813  1uF  [SMD CAP 0402]
C814  2.2uF  [SMD CAP 0402]
C815  2.2uF  [SMD CAP 0402]
C816  1uF  [SMD CAP 0402]
C817  0.1uF  [SMD CAP 0402]
C818  0.1uF  [SMD CAP 0402]
C819  0.1uF  [SMD CAP 0402]
C820  0.1uF  [SMD CAP 0402]
C821  0.1uF  [SMD CAP 0402]
C822  0.1uF  [SMD CAP 0402]
C823  4.7uF  [SMD CAP 0603]
C824  4.7uF  [SMD CAP 0603]
C825  4.7uF  [SMD CAP 0603]
L800  2.2uH  [IND SMD 0806]
L801  FB 1K  [SMD RES 0402]
R800  0R0  [SMD RES 0402]
R801  0R0  [SMD RES 0402]
R802  0R0  [SMD RES 0402]
TP800  TESTPOINT SMD  [TESTPOINT 1mm DIA]  (value not drawn)  (no BOM)
TP801  TESTPOINT SMD  [TESTPOINT 0.5mm DIA]  (value not drawn)  (no BOM)
TP802  TESTPOINT SMD  [TESTPOINT 0.5mm DIA]  (value not drawn)  (no BOM)
TP803  TESTPOINT SMD  [TESTPOINT 0.5mm DIA]  (value not drawn)  (no BOM)
TP804  TESTPOINT SMD  [TESTPOINT 0.5mm DIA]  (value not drawn)  (no BOM)
TP805  TESTPOINT SMD  [TESTPOINT 0.5mm DIA]  (value not drawn)  (no BOM)
U100  STM32H735ZGT6  [LQFP-144 20x20]  (part B of 3)

### Nets
GND: C800.2 C801.2 C802.1 C803.1 C804.1 C805.1 C806.1 C807.1 C808.1 C809.1 C810.2 C811.2 C812.1 C813.2 C814.1 C815.1 C816.2 C817.1 C818.1 C819.1 C820.1 C821.1 C822.1 C823.2 C824.2 C825.2 TP800.1 U100.6(VSS) U100.12(VSS) U100.14(VSSSMPS) U100.18(VSS) U100.33(VSS) U100.34(VSSA) U100.41(VSS) U100.55(VSS) U100.69(VSS) U100.80(VSS) U100.89(VSS) U100.104(VSS) U100.118(VSS) U100.128(VSS) U100.141(VSS)
V3_3D: R800.1 R802.2 TP801.1 U100.8(VBAT)
VDD_MCU: C800.1 C801.1 C802.2 C803.2 C804.2 C805.2 C806.2 C807.2 C808.2 C809.2 C817.2 C818.2 C819.2 C820.2 C821.2 L801.1 R800.2 U100.7(VDD) U100.13(VDD) U100.16(VDDSMPS) U100.19(VDD) U100.32(VDD) U100.42(VDD) U100.56(VDD) U100.71(VDD) U100.79(VDD) U100.92(VDD) U100.106(VDD) U100.119(VDD) U100.129(VDD) U100.144(VDD)
VDD_MCU_SMPS_OUT: C810.1 C811.1 C823.1 C824.1 C825.1 L800.1 TP802.1 U100.17(VFBSMPS) U100.70(VDDLDO) U100.105(VDDLDO) U100.143(VDD_LDO)
VDDA: C822.2 L801.2 TP805.1 U100.35(VREF+) U100.36(VDDA)
VUSB_VBUS: R801.2 TP804.1
MCU_CORE: C814.2 C815.2 TP803.1 U100.68(VCAP) U100.103(VCAP) U100.140(VCAP)
VDD33USB: C816.1 R802.1 U100.91(VDD33USB)
VDD50USB: C813.1 R801.1 U100.90(VDD50USB)
VLXSMPS: C812.2 L800.2 U100.15(VLXSMPS)

### Notes on the sheet
- (in symbol IC MCU STM32H735ZG Arm M7, part B) 2 of 3

### Library data of the parts
C800 C810 C811 = CAP MLCC SMD: as C201 on sheet QCLogic Rev A Sht2 WiFi; 3. Date Modified: 20201128
C801 C823-C825 = CAP MLCC SMD: CAP CER 4.7UF 16V X7S 0603; 1. Manufacturer: Murata Electronics; 2. Manufacturer Part Number: GRM188C71C475KE21D; 4. Package: 0603; 3. Date Modified: 20200906
C802-C809 C817-C822 = CAP MLCC SMD: as C100 on sheet QCLogic Rev A Sht1 MCU IO; 3. Date Modified: 20201122
C812 = CAP MLCC SMD: CAP CER 220PF 50V X7R 0402; 1. Manufacturer: Yageo; 2. Manufacturer Part Number: CC0402KRX7R9BB221; 4. Package: 0402; 3. Date Modified: 20201125
C813 C816 = CAP MLCC SMD: CAP CER 1UF 25V X5R 0402; 1. Manufacturer: Murata Electronics; 2. Manufacturer Part Number: GRT155R61E105KE01D; 4. Package: 0402; 3. Date Modified: 20200805
C814 C815 = CAP MLCC SMD: CAP CER 2.2UF 16V X6S 0402; 1. Manufacturer: Murata Electronics; 2. Manufacturer Part Number: GRM155C81C225ME15D; 4. Package: 0402; 3. Date Modified: 20200914
L800 = INDUCTOR: IND FIXED 2.2UH 1.2A 138 MOHM; 1. Manufacturer: Murata Electronics; 2. Manufacturer Part Number: LQM2MPN2R2NG0L; 3. Date Modified: 20201125
L801 = INDUCTOR: as L300 on sheet QCLogic Rev A Sht3 GPS; 3. Date Modified: 20201122
R800-R802 = RES SMD: as R100 on sheet QCLogic Rev A Sht1 MCU IO; 3. Date Modified: 20201122
TP800-TP805 = TESTPOINT PAD: TESTPOINT SMD PAD; 1. Manufacturer: *; 2. Manufacturer Part Number: *; 3. Date Modified: *
U100 = IC MCU STM32H735ZG Arm M7: as U100 on sheet QCLogic Rev A Sht1 MCU IO; 2. Manufacturer Part Number: STM32H735ZGT6; 3. Date Modified: 20201126